# Altium project bhumishboard.PrjPcb (part 1 of 2)
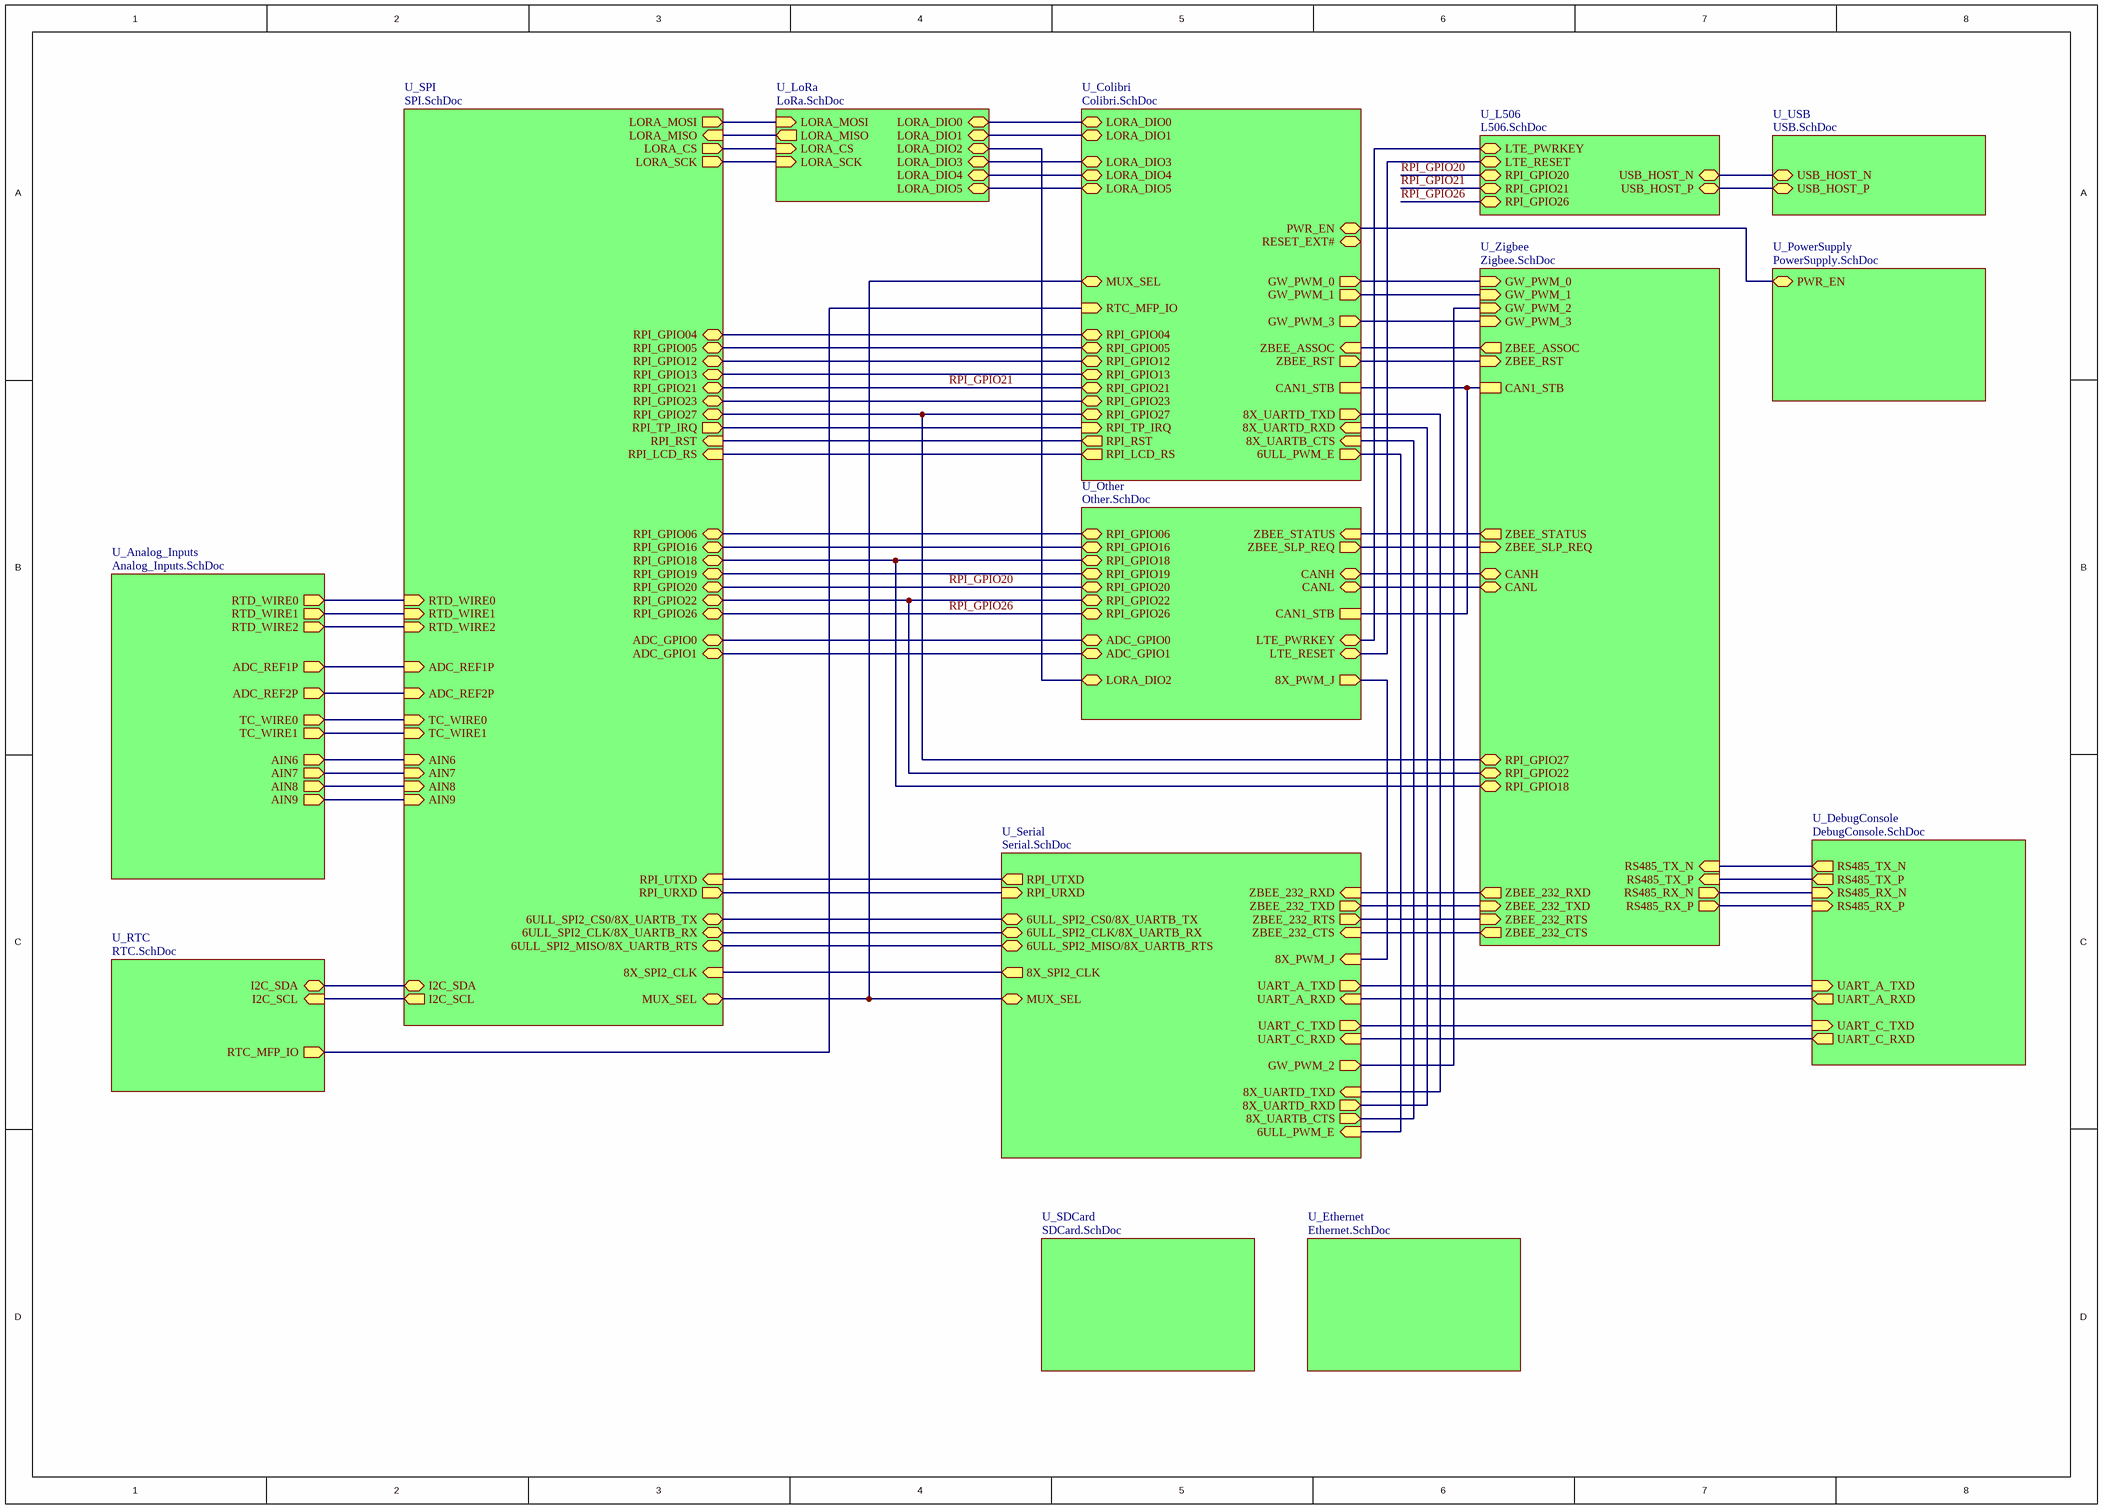
[diagram p0: HardwareArchitecture.SchDoc]
15 sheets, 269 parts. Net scope: hierarchical (ports join the sheet entries above them; power ports are global).
Sheets:
  HardwareArchitecture.SchDoc
    U_Analog_Inputs = Analog_Inputs.SchDoc
    U_Colibri = Colibri.SchDoc
    U_L506 = L506.SchDoc
    U_LoRa = LoRa.SchDoc
    U_Other = Other.SchDoc
    U_PowerSupply = PowerSupply.SchDoc
    U_SDCard = SDCard.SchDoc
    U_Serial = Serial.SchDoc
    U_SPI = SPI.SchDoc
    U_USB = USB.SchDoc
    U_Zigbee = Zigbee.SchDoc
    U_Ethernet = Ethernet.SchDoc
    U_RTC = RTC.SchDoc
    U_DebugConsole = DebugConsole.SchDoc

## Sheet HardwareArchitecture.SchDoc: Iris
size A3; Organization: Toradex AG; Address1: Altsagenstrasse 5; Address2: Horw; Address3: 6048; Address4: Switzerland; DocumentNumber: 2; Revision: V2.0; SheetNumber: 2; SheetTotal: 16; PageSetup: Record=PageOptions|CenterHorizontal=True|CenterVertical=True|PrintScale=0.73|XCorrection=1.00|YCorrection=1.00|PrintKind=0|BorderSize=5000000|LeftOffset=0|BottomOffset=0|Orientation=2|PaperLength=1000|PaperWidth=1000|Scale=100|PaperSource=7|PrintQuality=600|MediaType=1|DitherType=10|PaperKind=A4|PrintScaleMode=1

### Sub-sheets
U_Analog_Inputs = Analog_Inputs.SchDoc: ADC_REF1P (out), RTD_WIRE0 (out), RTD_WIRE1 (out), RTD_WIRE2 (out), TC_WIRE0 (out), TC_WIRE1 (out), ADC_REF2P (out), AIN8 (out), AIN9 (out), AIN7 (out), AIN6 (out)
U_Colibri = Colibri.SchDoc: RESET_EXT# (bidir), RTC_MFP_IO (in), 8X_UARTD_RXD (in), 8X_UARTD_TXD (out), 8X_UARTB_CTS (in), 6ULL_PWM_E (out), GW_PWM_3 (out), GW_PWM_0 (out), GW_PWM_1 (out), MUX_SEL (bidir), ZBEE_RST (out), RPI_LCD_RS (out), RPI_RST (out), RPI_TP_IRQ (in), LORA_DIO0 (bidir), LORA_DIO1 (bidir), LORA_DIO3 (bidir), LORA_DIO4 (bidir), LORA_DIO5 (bidir), ZBEE_ASSOC (in), RPI_GPIO04 (bidir), RPI_GPIO27 (bidir), RPI_GPIO05 (bidir), RPI_GPIO13 (bidir), RPI_GPIO21 (bidir), RPI_GPIO12 (bidir), RPI_GPIO23 (bidir), PWR_EN (bidir), CAN1_STB
U_DebugConsole = DebugConsole.SchDoc: UART_C_TXD (in), UART_C_RXD (out), UART_A_TXD (in), UART_A_RXD (out), RS485_RX_N (in), RS485_RX_P (in), RS485_TX_N (out), RS485_TX_P (out)
U_Ethernet = Ethernet.SchDoc: no entries
U_L506 = L506.SchDoc: LTE_PWRKEY (bidir), LTE_RESET (bidir), USB_HOST_N (bidir), USB_HOST_P (bidir), RPI_GPIO20 (bidir), RPI_GPIO21 (bidir), RPI_GPIO26 (bidir)
U_LoRa = LoRa.SchDoc: LORA_MISO (out), LORA_MOSI (in), LORA_CS (in), LORA_SCK (in), LORA_DIO0 (bidir), LORA_DIO1 (bidir), LORA_DIO2 (bidir), LORA_DIO4 (bidir), LORA_DIO3 (bidir), LORA_DIO5 (bidir)
U_Other = Other.SchDoc: 8X_PWM_J (out), LORA_DIO2 (bidir), ZBEE_SLP_REQ (out), ZBEE_STATUS (in), RPI_GPIO22 (bidir), RPI_GPIO06 (bidir), RPI_GPIO19 (bidir), RPI_GPIO26 (bidir), RPI_GPIO20 (bidir), RPI_GPIO16 (bidir), RPI_GPIO18 (bidir), ADC_GPIO0 (bidir), ADC_GPIO1 (bidir), CANH (bidir), CANL (bidir), LTE_PWRKEY (bidir), LTE_RESET (bidir), CAN1_STB
U_PowerSupply = PowerSupply.SchDoc: PWR_EN (bidir)
U_RTC = RTC.SchDoc: RTC_MFP_IO (out), I2C_SDA (bidir), I2C_SCL (in)
U_SDCard = SDCard.SchDoc: no entries
U_Serial = Serial.SchDoc: 8X_UARTD_RXD (out), 8X_UARTD_TXD (in), 8X_SPI2_CLK (out), 8X_UARTB_CTS (out), MUX_SEL (bidir), ZBEE_232_TXD (out), ZBEE_232_RXD (in), ZBEE_232_RTS (out), ZBEE_232_CTS (in), RPI_UTXD (out), RPI_URXD (in), 8X_PWM_J (in), 6ULL_PWM_E (in), GW_PWM_2 (out), 6ULL_SPI2_CLK/8X_UARTB_RX (bidir), 6ULL_SPI2_CS0/8X_UARTB_TX (bidir), UART_A_TXD (out), UART_A_RXD (in), UART_C_RXD (in), UART_C_TXD (out), 6ULL_SPI2_MISO/8X_UARTB_RTS (bidir)
U_SPI = SPI.SchDoc: RPI_TP_IRQ (out), RPI_LCD_RS (in), RPI_RST (in), MUX_SEL (bidir), 8X_SPI2_CLK (in), LORA_MISO (in), LORA_MOSI (out), LORA_CS (out), LORA_SCK (out), RPI_UTXD (in), RPI_URXD (out), I2C_SCL (out), I2C_SDA (bidir), RPI_GPIO04 (bidir), RPI_GPIO27 (bidir), RPI_GPIO05 (bidir), RPI_GPIO13 (bidir), RPI_GPIO21 (bidir), RPI_GPIO12 (bidir), RPI_GPIO23 (bidir), ADC_GPIO0 (bidir), ADC_GPIO1 (bidir), 6ULL_SPI2_CLK/8X_UARTB_RX (bidir), 6ULL_SPI2_CS0/8X_UARTB_TX (bidir), 6ULL_SPI2_MISO/8X_UARTB_RTS (bidir), RTD_WIRE0 (in), RTD_WIRE1 (in), TC_WIRE0 (in), TC_WIRE1 (in), AIN6 (in), AIN7 (in), AIN8 (in), AIN9 (in), ADC_REF1P (in), ADC_REF2P (in), RTD_WIRE2 (in), RPI_GPIO06 (bidir), RPI_GPIO16 (bidir), RPI_GPIO18 (bidir), RPI_GPIO19 (bidir), RPI_GPIO20 (bidir), RPI_GPIO22 (bidir), RPI_GPIO26 (bidir)
U_USB = USB.SchDoc: USB_HOST_N (bidir), USB_HOST_P (bidir)
U_Zigbee = Zigbee.SchDoc: ZBEE_RST (in), ZBEE_SLP_REQ (in), ZBEE_STATUS (out), ZBEE_ASSOC (out), CANH (bidir), GW_PWM_1 (in), GW_PWM_0 (in), GW_PWM_2 (in), GW_PWM_3 (in), RS485_TX_N (in), RS485_TX_P (in), RS485_RX_N (out), RS485_RX_P (out), CANL (bidir), ZBEE_232_RXD (out), ZBEE_232_TXD (in), ZBEE_232_RTS (in), ZBEE_232_CTS (out), RPI_GPIO27 (bidir), RPI_GPIO22 (bidir), RPI_GPIO18 (bidir), CAN1_STB

### Nets
6ULL_PWM_E: sheet U_Colibri/6ULL_PWM_E, sheet U_Serial/6ULL_PWM_E
6ULL_SPI2_CLK/8X_UARTB_RX: sheet U_Serial/6ULL_SPI2_CLK/8X_UARTB_RX, sheet U_SPI/6ULL_SPI2_CLK/8X_UARTB_RX
6ULL_SPI2_CS0/8X_UARTB_TX: sheet U_Serial/6ULL_SPI2_CS0/8X_UARTB_TX, sheet U_SPI/6ULL_SPI2_CS0/8X_UARTB_TX
6ULL_SPI2_MISO/8X_UARTB_RTS: sheet U_Serial/6ULL_SPI2_MISO/8X_UARTB_RTS, sheet U_SPI/6ULL_SPI2_MISO/8X_UARTB_RTS
8X_PWM_J: sheet U_Other/8X_PWM_J, sheet U_Serial/8X_PWM_J
8X_SPI2_CLK: sheet U_Serial/8X_SPI2_CLK, sheet U_SPI/8X_SPI2_CLK
8X_UARTB_CTS: sheet U_Colibri/8X_UARTB_CTS, sheet U_Serial/8X_UARTB_CTS
8X_UARTD_RXD: sheet U_Colibri/8X_UARTD_RXD, sheet U_Serial/8X_UARTD_RXD
8X_UARTD_TXD: sheet U_Colibri/8X_UARTD_TXD, sheet U_Serial/8X_UARTD_TXD
ADC_GPIO0: sheet U_Other/ADC_GPIO0, sheet U_SPI/ADC_GPIO0
ADC_GPIO1: sheet U_Other/ADC_GPIO1, sheet U_SPI/ADC_GPIO1
ADC_REF1P: sheet U_Analog_Inputs/ADC_REF1P, sheet U_SPI/ADC_REF1P
AIN6: sheet U_Analog_Inputs/AIN6, sheet U_SPI/AIN6
AIN7: sheet U_Analog_Inputs/AIN7, sheet U_SPI/AIN7
AIN8: sheet U_Analog_Inputs/AIN8, sheet U_SPI/AIN8
AIN9: sheet U_Analog_Inputs/ADC_REF2P, sheet U_Analog_Inputs/AIN9, sheet U_SPI/AIN9, sheet U_SPI/ADC_REF2P
CAN1_STB: sheet U_Colibri/CAN1_STB, sheet U_Other/CAN1_STB, sheet U_Zigbee/CAN1_STB
CANH: sheet U_Other/CANH, sheet U_Zigbee/CANH
CANL: sheet U_Other/CANL, sheet U_Zigbee/CANL
GW_PWM_0: sheet U_Colibri/GW_PWM_0, sheet U_Zigbee/GW_PWM_0
GW_PWM_1: sheet U_Colibri/GW_PWM_1, sheet U_Zigbee/GW_PWM_1
GW_PWM_2: sheet U_Serial/GW_PWM_2, sheet U_Zigbee/GW_PWM_2
GW_PWM_3: sheet U_Colibri/GW_PWM_3, sheet U_Zigbee/GW_PWM_3
I2C_SCL: sheet U_SPI/I2C_SCL, sheet U_RTC/I2C_SCL
I2C_SDA: sheet U_SPI/I2C_SDA, sheet U_RTC/I2C_SDA
LORA_CS: sheet U_LoRa/LORA_CS, sheet U_SPI/LORA_CS
LORA_DIO0: sheet U_Colibri/LORA_DIO0, sheet U_LoRa/LORA_DIO0
LORA_DIO1: sheet U_Colibri/LORA_DIO1, sheet U_LoRa/LORA_DIO1
LORA_DIO2: sheet U_LoRa/LORA_DIO2, sheet U_Other/LORA_DIO2
LORA_DIO3: sheet U_Colibri/LORA_DIO3, sheet U_LoRa/LORA_DIO3
LORA_DIO4: sheet U_Colibri/LORA_DIO4, sheet U_LoRa/LORA_DIO4
LORA_DIO5: sheet U_Colibri/LORA_DIO5, sheet U_LoRa/LORA_DIO5
LORA_MISO: sheet U_LoRa/LORA_MISO, sheet U_SPI/LORA_MISO
LORA_MOSI: sheet U_LoRa/LORA_MOSI, sheet U_SPI/LORA_MOSI
LORA_SCK: sheet U_LoRa/LORA_SCK, sheet U_SPI/LORA_SCK
LTE_PWRKEY: sheet U_L506/LTE_PWRKEY, sheet U_Other/LTE_PWRKEY
LTE_RESET: sheet U_L506/LTE_RESET, sheet U_Other/LTE_RESET
MUX_SEL: sheet U_Colibri/MUX_SEL, sheet U_Serial/MUX_SEL, sheet U_SPI/MUX_SEL
PWR_EN: sheet U_Colibri/PWR_EN, sheet U_PowerSupply/PWR_EN
RPI_GPIO04: sheet U_Colibri/RPI_GPIO04, sheet U_SPI/RPI_GPIO04
RPI_GPIO05: sheet U_Colibri/RPI_GPIO05, sheet U_SPI/RPI_GPIO05
RPI_GPIO06: sheet U_Other/RPI_GPIO06, sheet U_SPI/RPI_GPIO06
RPI_GPIO12: sheet U_Colibri/RPI_GPIO12, sheet U_SPI/RPI_GPIO12
RPI_GPIO13: sheet U_Colibri/RPI_GPIO13, sheet U_SPI/RPI_GPIO13
RPI_GPIO16: sheet U_Other/RPI_GPIO16, sheet U_SPI/RPI_GPIO16
RPI_GPIO18: sheet U_Other/RPI_GPIO18, sheet U_SPI/RPI_GPIO18, sheet U_Zigbee/RPI_GPIO18
RPI_GPIO19: sheet U_Other/RPI_GPIO19, sheet U_SPI/RPI_GPIO19
RPI_GPIO20: sheet U_L506/RPI_GPIO20, sheet U_Other/RPI_GPIO20, sheet U_SPI/RPI_GPIO20
RPI_GPIO21: sheet U_Colibri/RPI_GPIO21, sheet U_L506/RPI_GPIO21, sheet U_SPI/RPI_GPIO21
RPI_GPIO22: sheet U_Other/RPI_GPIO22, sheet U_SPI/RPI_GPIO22, sheet U_Zigbee/RPI_GPIO22
RPI_GPIO23: sheet U_Colibri/RPI_GPIO23, sheet U_SPI/RPI_GPIO23
RPI_GPIO26: sheet U_L506/RPI_GPIO26, sheet U_Other/RPI_GPIO26, sheet U_SPI/RPI_GPIO26
RPI_GPIO27: sheet U_Colibri/RPI_GPIO27, sheet U_SPI/RPI_GPIO27, sheet U_Zigbee/RPI_GPIO27
RPI_LCD_RS: sheet U_Colibri/RPI_LCD_RS, sheet U_SPI/RPI_LCD_RS
RPI_RST: sheet U_Colibri/RPI_RST, sheet U_SPI/RPI_RST
RPI_TP_IRQ: sheet U_Colibri/RPI_TP_IRQ, sheet U_SPI/RPI_TP_IRQ
RPI_URXD: sheet U_Serial/RPI_URXD, sheet U_SPI/RPI_URXD
RPI_UTXD: sheet U_Serial/RPI_UTXD, sheet U_SPI/RPI_UTXD
RS485_RX_N: sheet U_Zigbee/RS485_RX_N, sheet U_DebugConsole/RS485_RX_N
RS485_RX_P: sheet U_Zigbee/RS485_RX_P, sheet U_DebugConsole/RS485_RX_P
RS485_TX_N: sheet U_Zigbee/RS485_TX_N, sheet U_DebugConsole/RS485_TX_N
RS485_TX_P: sheet U_Zigbee/RS485_TX_P, sheet U_DebugConsole/RS485_TX_P
RTC_MFP_IO: sheet U_Colibri/RTC_MFP_IO, sheet U_RTC/RTC_MFP_IO
RTD_WIRE0: sheet U_Analog_Inputs/RTD_WIRE0, sheet U_SPI/RTD_WIRE0
RTD_WIRE1: sheet U_Analog_Inputs/RTD_WIRE1, sheet U_SPI/RTD_WIRE1
RTD_WIRE2: sheet U_Analog_Inputs/RTD_WIRE2, sheet U_SPI/RTD_WIRE2
TC_WIRE0: sheet U_Analog_Inputs/TC_WIRE0, sheet U_SPI/TC_WIRE0
TC_WIRE1: sheet U_Analog_Inputs/TC_WIRE1, sheet U_SPI/TC_WIRE1
UART_A_RXD: sheet U_Serial/UART_A_RXD, sheet U_DebugConsole/UART_A_RXD
UART_A_TXD: sheet U_Serial/UART_A_TXD, sheet U_DebugConsole/UART_A_TXD
UART_C_RXD: sheet U_Serial/UART_C_RXD, sheet U_DebugConsole/UART_C_RXD
UART_C_TXD: sheet U_Serial/UART_C_TXD, sheet U_DebugConsole/UART_C_TXD
USB_HOST_N: sheet U_L506/USB_HOST_N, sheet U_USB/USB_HOST_N
USB_HOST_P: sheet U_L506/USB_HOST_P, sheet U_USB/USB_HOST_P
ZBEE_232_CTS: sheet U_Serial/ZBEE_232_CTS, sheet U_Zigbee/ZBEE_232_CTS
ZBEE_232_RTS: sheet U_Serial/ZBEE_232_RTS, sheet U_Zigbee/ZBEE_232_RTS
ZBEE_232_RXD: sheet U_Serial/ZBEE_232_RXD, sheet U_Zigbee/ZBEE_232_RXD
ZBEE_232_TXD: sheet U_Serial/ZBEE_232_TXD, sheet U_Zigbee/ZBEE_232_TXD
ZBEE_ASSOC: sheet U_Colibri/ZBEE_ASSOC, sheet U_Zigbee/ZBEE_ASSOC
ZBEE_RST: sheet U_Colibri/ZBEE_RST, sheet U_Zigbee/ZBEE_RST
ZBEE_SLP_REQ: sheet U_Other/ZBEE_SLP_REQ, sheet U_Zigbee/ZBEE_SLP_REQ
ZBEE_STATUS: sheet U_Other/ZBEE_STATUS, sheet U_Zigbee/ZBEE_STATUS

### Notes on the sheet
- Title
- Size:
- Date:
- A3
- Number:
- Time:
- Revision:
- Sheet
- of
- File:

## Sheet Analog_Inputs.SchDoc
size A4
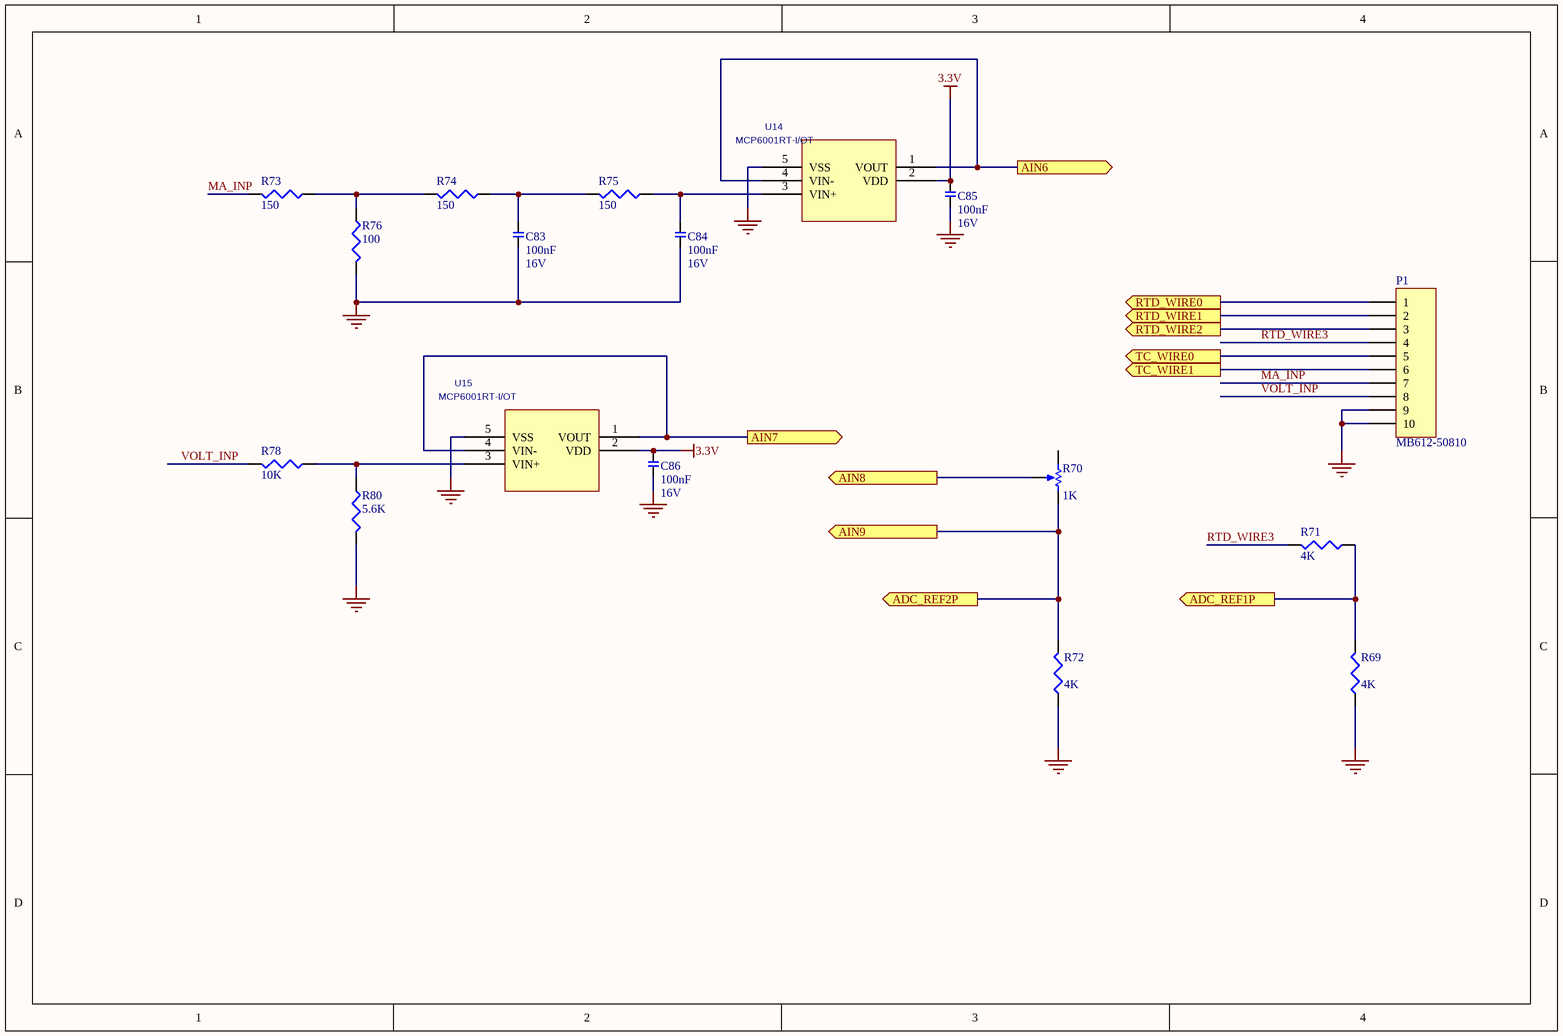
[diagram p1: Analog_Inputs.SchDoc]

### Parts
C83  Rating: 16V  [T_CAPC0603X33N]  (hidden comment: 100nF)
C84  Rating: 16V  [T_CAPC0603X33N]  (hidden comment: 100nF)
C85  Rating: 16V  [T_CAPC0603X33N]  (hidden comment: 100nF)
C86  Rating: 16V  [T_CAPC0603X33N]  (hidden comment: 100nF)
P1  MB612-50810  [1729186 5.08 - 10pos]
R69  value 4K  [J1-0603]  (hidden comment: Res3)
R70  value 1K  [VR5]  (hidden comment: RPot)
R71  value 4K  [J1-0603]  (hidden comment: Res3)
R72  value 4K  [J1-0603]  (hidden comment: Res3)
R73  value 150  [J1-0603]  (hidden comment: Res3)
R74  value 150  [J1-0603]  (hidden comment: Res3)
R75  value 150  [J1-0603]  (hidden comment: Res3)
R76  value 100  [J1-0603]  (hidden comment: Res3)
R78  value 10K  [J1-0603]  (hidden comment: Res3)
R80  value 5.6K  [J1-0603]  (hidden comment: Res3)
U14  MCP6001RT-I/OT  [SOT-23-5]
U15  MCP6001RT-I/OT  [SOT-23-5]

### Ports
ADC_REF1P (out), ADC_REF2P (out), AIN6 (out), AIN7 (out), AIN8 (out), AIN9 (out), RTD_WIRE0 (out), RTD_WIRE1 (out), RTD_WIRE2 (out), TC_WIRE0 (out), TC_WIRE1 (out)

### Nets
3.3V: C85.2 C86.2 U14.2(VDD) U15.2(VDD)
GND: C83.1 C84.1 C85.1 C86.1 P1.9 P1.10 R69.1 R72.1 R76.2 R80.2 U14.5(VSS) U15.5(VSS)
ADC_REF1P: R69.2 R71.1 ; port ADC_REF1P
AIN6: U14.1(VOUT) U14.4(VIN-) ; port AIN6
AIN7: U15.1(VOUT) U15.4(VIN-) ; port AIN7
AIN8: R70.3(TAP) ; port AIN8
AIN9: R70.2(BOT) R72.2 ; port ADC_REF2P, port AIN9
MA_INP: P1.7 R73.2
RTD_WIRE0: P1.1 ; port RTD_WIRE0
RTD_WIRE1: P1.2 ; port RTD_WIRE1
RTD_WIRE2: P1.3 ; port RTD_WIRE2
RTD_WIRE3: P1.4 R71.2
TC_WIRE0: P1.5 ; port TC_WIRE0
TC_WIRE1: P1.6 ; port TC_WIRE1
VOLT_INP: P1.8 R78.2
NetC83_2: C83.2 R74.1 R75.2
NetC84_2: C84.2 R75.1 U14.3(VIN+)
NetR73_1: R73.1 R74.2 R76.1
NetR78_1: R78.1 R80.1 U15.3(VIN+)

Not connected (* = marked no-connect by the designer): R70 1(TOP)

### Library data of the parts
C83-C86 = C-X7R-100nF-16V-10%-0603: Capacitor Ceramic X7R 100nF 16V 10% 0603; Tolerance: 10%; Type: X7R; Value: 100nF
P1 = Header 10: Header, 10-Pin; LatestRevisionDate: 17-Jul-2002; LatestRevisionNote: Re-released for DXP Platform.; Publisher: Altium Limited
R69 R71-R76 R78 R80 = Res3: Resistor; Published: 8-Jun-2000; LatestRevisionDate: 29-May-2009; LatestRevisionNote: IPC-7351 Footprint Added.; PackageReference: J1-0603; Publisher: Altium Limited; PackageDescription: Chip Resistor
R70 = RPot: Potentiometer; Sim Note: Enter the Resistance value and the set point into parameter fields.; Set Position: 0.5; Published: 8-Jun-2000; LatestRevisionDate: 17-Jul-2002; LatestRevisionNote: Re-released for DXP Platform.; PackageReference: VR5; Publisher: Altium Limited; PackageDescription: Variable Resistor, Thru-Hole; 3 Leads
U14 U15 = MCP6001RT-I/OT: C: Copyright (C) 2015 Accelerated Designs. All rights reserved; Vendor: Microchip; Built_By: EMA_UL_Team; SourceLibrary: Microchip_2011-05-13; Value: mcp6001rt-i/ot; Manufacturer_Part_Number: mcp6001rt-i/ot

## Sheet Colibri.SchDoc: Iris
size A3; Organization: Toradex AG; Address1: Altsagenstrasse 5; Address2: Horw; Address3: 6048; Address4: Switzerland; DocumentNumber: 4; Revision: V2.0; SheetNumber: 4; SheetTotal: 16
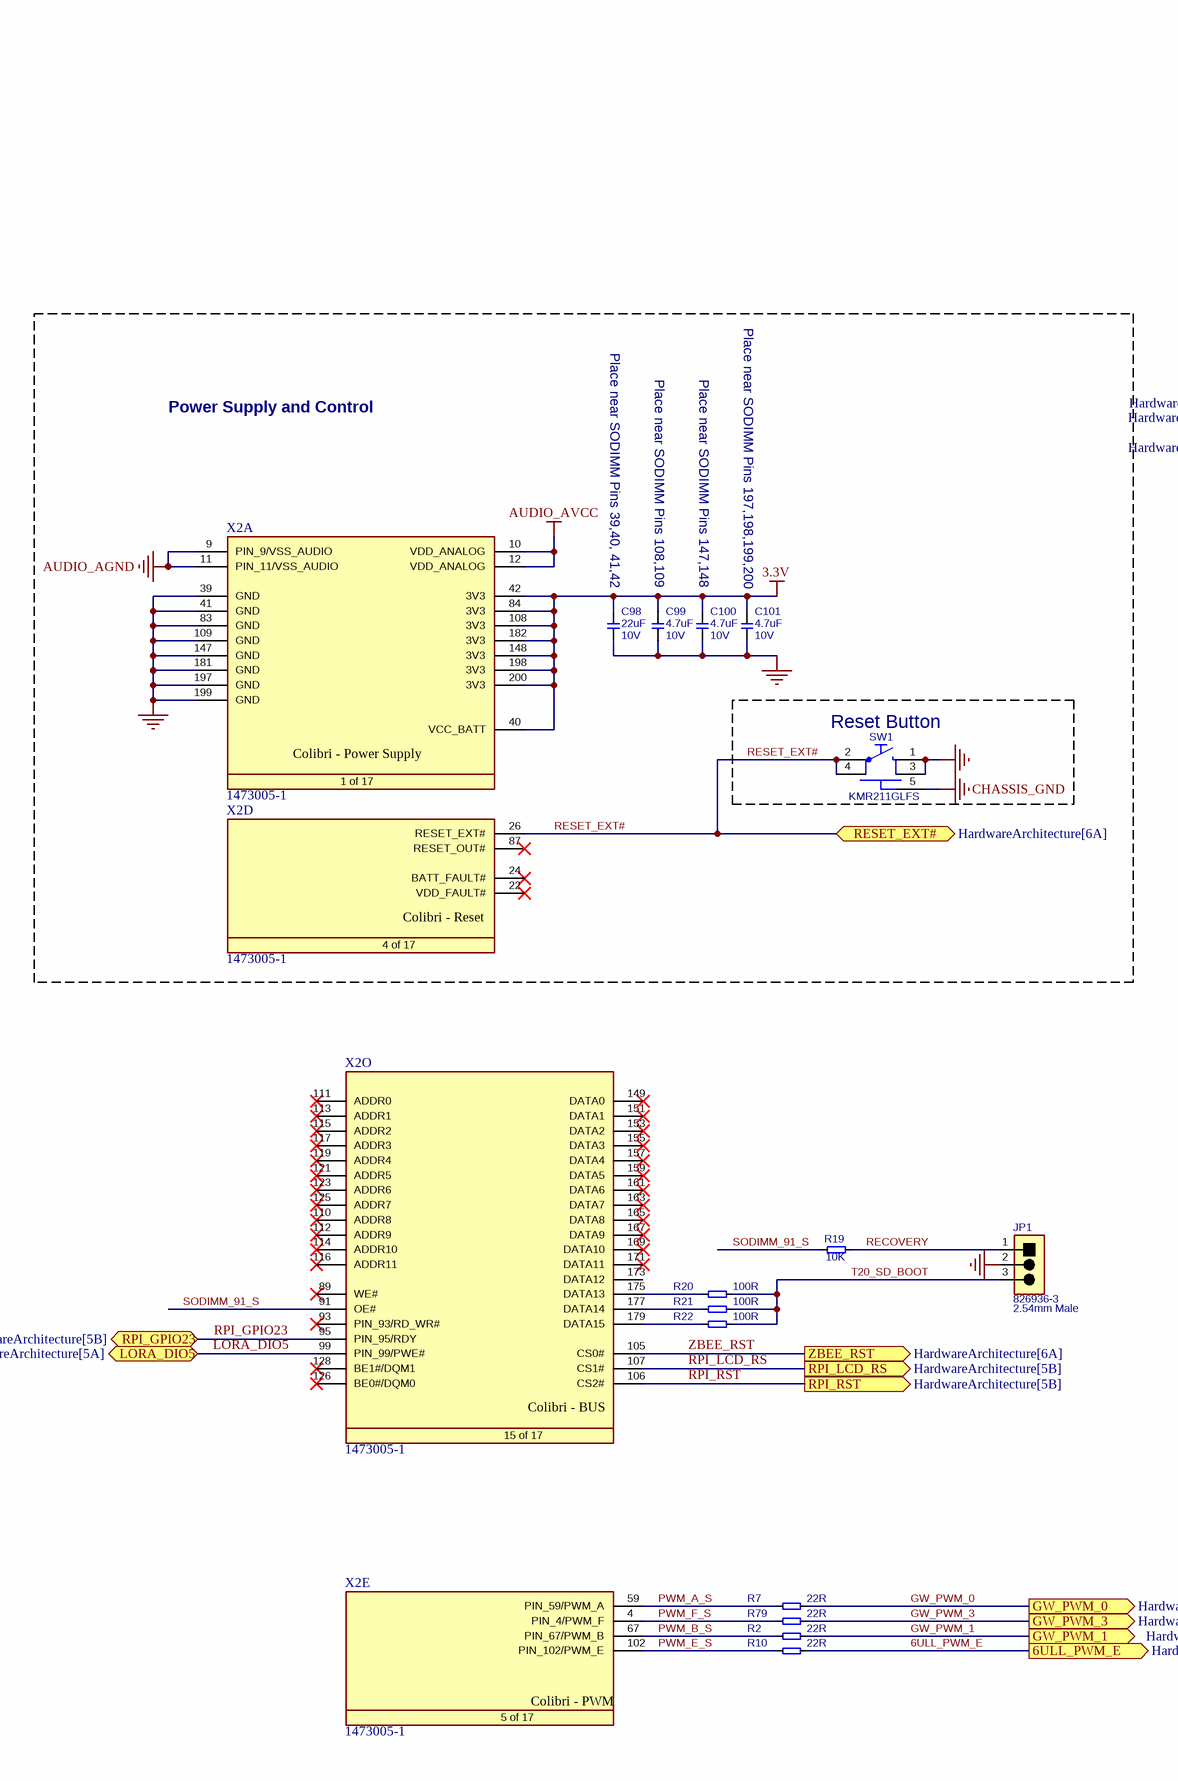
[diagram p2: Colibri.SchDoc, left]
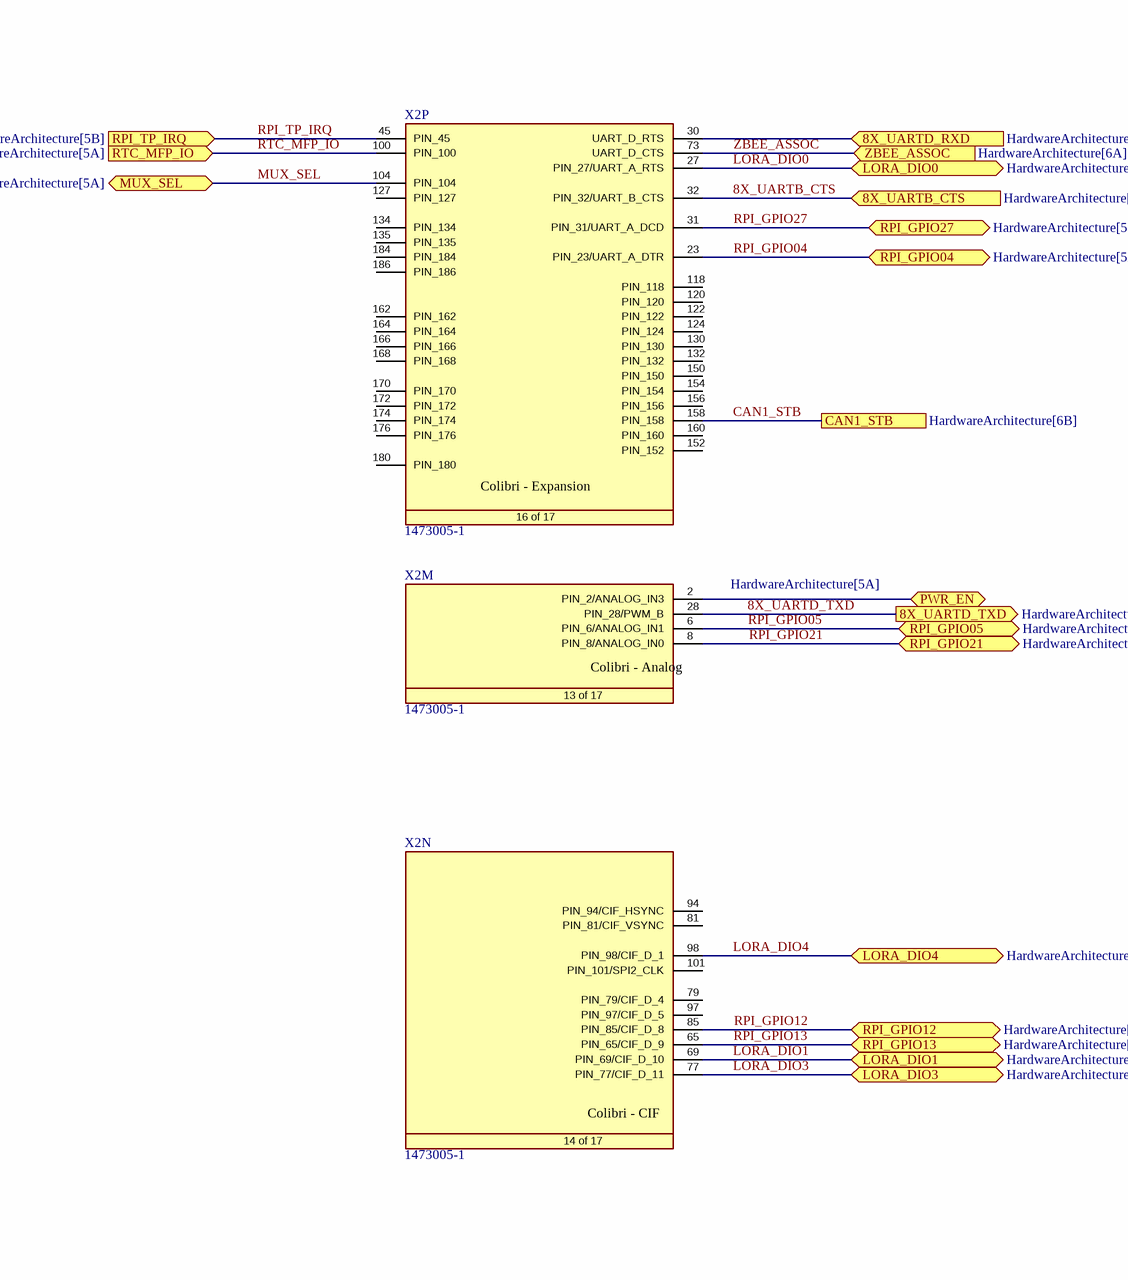
[diagram p3: Colibri.SchDoc, right]

### Parts
C98  Rating: 10V  [T_CAPC0805X125N]  (hidden comment: 22uF)
C99  Rating: 10V  [T_CAPC0603X33N]  (hidden comment: 4.7uF)
C100  Rating: 10V  [T_CAPC0603X33N]  (hidden comment: 4.7uF)
C101  Rating: 10V  [T_CAPC0603X33N]  (hidden comment: 4.7uF)
JP1  826936-3  [T_TYCO_826936-3]
R2  22R  [RESC1005X40N]
R7  22R  [RESC1005X40N]
R10  22R  [RESC1005X40N]
R19  10K  [RESC1005X40N]
R20  100R  [T_RESC0603X30N]
R21  100R  [T_RESC0603X30N]
R22  100R  [T_RESC0603X30N]
R79  22R  [RESC1005X40N]
SW1  KMR211GLFS  [T_CnK_KMR211GLFS]
X2  1473005-1  [T_Tyco_1473005-1]  (parts A,D,E,M,N,O,P of 17)

### Blocks framed on the sheet
Power Supply and Control: C98-C101 X2
Reset Button: SW1

### Ports
6ULL_PWM_E (out, see HardwareArchitecture[6B]), 8X_UARTB_CTS (in, see HardwareArchitecture[6B]), 8X_UARTD_RXD (in, see HardwareArchitecture[6B]), 8X_UARTD_TXD (out, see HardwareArchitecture[6B]), CAN1_STB (see HardwareArchitecture[6B]), GW_PWM_0 (out, see HardwareArchitecture[6A]), GW_PWM_1 (out, see HardwareArchitecture[6A]), GW_PWM_3 (out, see HardwareArchitecture[6A]), LORA_DIO0 (bidir, see HardwareArchitecture[5A]), LORA_DIO1 (bidir, see HardwareArchitecture[5A]), LORA_DIO3 (bidir, see HardwareArchitecture[5A]), LORA_DIO4 (bidir, see HardwareArchitecture[5A]), LORA_DIO5 (bidir, see HardwareArchitecture[5A]), MUX_SEL (bidir, see HardwareArchitecture[5A]), PWR_EN (bidir, see HardwareArchitecture[5A]), RESET_EXT# (bidir, see HardwareArchitecture[6A]), RPI_GPIO04 (bidir, see HardwareArchitecture[5A]), RPI_GPIO05 (bidir, see HardwareArchitecture[5A]), RPI_GPIO12 (bidir, see HardwareArchitecture[5A]), RPI_GPIO13 (bidir, see HardwareArchitecture[5A]), RPI_GPIO21 (bidir, see HardwareArchitecture[5B]), RPI_GPIO23 (bidir, see HardwareArchitecture[5B]), RPI_GPIO27 (bidir, see HardwareArchitecture[5B]), RPI_LCD_RS (out, see HardwareArchitecture[5B]), RPI_RST (out, see HardwareArchitecture[5B]), RPI_TP_IRQ (in, see HardwareArchitecture[5B]), RTC_MFP_IO (in, see HardwareArchitecture[5A]), ZBEE_ASSOC (in, see HardwareArchitecture[6A]), ZBEE_RST (out, see HardwareArchitecture[6A])

### Nets
3.3V: C98.2 C99.1 C100.1 C101.1 X2.40(VCC_BATT) X2.42(3V3) X2.84(3V3) X2.108(3V3) X2.148(3V3) X2.182(3V3) X2.198(3V3) X2.200(3V3)
AUDIO_AGND: X2.9(PIN_9/VSS_AUDIO) X2.11(PIN_11/VSS_AUDIO)
AUDIO_AVCC: X2.10(VDD_ANALOG) X2.12(VDD_ANALOG)
CHASSIS_GND: SW1.5
GND: C98.1 C99.2 C100.2 C101.2 JP1.2 SW1.1 SW1.3 X2.39(GND) X2.41(GND) X2.83(GND) X2.109(GND) X2.147(GND) X2.181(GND) X2.197(GND) X2.199(GND)
6ULL_PWM_E: R10.2 ; port 6ULL_PWM_E
8X_UARTB_CTS: X2.32(PIN_32/UART_B_CTS) ; port 8X_UARTB_CTS
8X_UARTD_RXD: X2.30(UART_D_RTS) ; port 8X_UARTD_RXD
8X_UARTD_TXD: X2.28(PIN_28/PWM_B) ; port 8X_UARTD_TXD
CAN1_STB: X2.158(PIN_158) ; port CAN1_STB
GW_PWM_0: R7.2 ; port GW_PWM_0
GW_PWM_1: R2.2 ; port GW_PWM_1
GW_PWM_3: R79.2 ; port GW_PWM_3
LORA_DIO0: X2.27(PIN_27/UART_A_RTS) ; port LORA_DIO0
LORA_DIO1: X2.69(PIN_69/CIF_D_10) ; port LORA_DIO1
LORA_DIO3: X2.77(PIN_77/CIF_D_11) ; port LORA_DIO3
LORA_DIO4: X2.98(PIN_98/CIF_D_1) ; port LORA_DIO4
LORA_DIO5: X2.99(PIN_99/PWE#) ; port LORA_DIO5
MUX_SEL: X2.104(PIN_104) ; port MUX_SEL
PWM_A_S: R7.1 X2.59(PIN_59/PWM_A)
PWM_B_S: R2.1 X2.67(PIN_67/PWM_B)
PWM_E_S: R10.1 X2.102(PIN_102/PWM_E)
PWM_F_S: R79.1 X2.4(PIN_4/PWM_F)
PWR_EN: X2.2(PIN_2/ANALOG_IN3) ; port PWR_EN
RECOVERY: JP1.1 R19.2
RESET_EXT#: SW1.2 SW1.4 X2.26(RESET_EXT#) ; port RESET_EXT#
RPI_GPIO04: X2.23(PIN_23/UART_A_DTR) ; port RPI_GPIO04
RPI_GPIO05: X2.6(PIN_6/ANALOG_IN1) ; port RPI_GPIO05
RPI_GPIO12: X2.85(PIN_85/CIF_D_8) ; port RPI_GPIO12
RPI_GPIO13: X2.65(PIN_65/CIF_D_9) ; port RPI_GPIO13
RPI_GPIO21: X2.8(PIN_8/ANALOG_IN0) ; port RPI_GPIO21
RPI_GPIO23: X2.95(PIN_95/RDY) ; port RPI_GPIO23
RPI_GPIO27: X2.31(PIN_31/UART_A_DCD) ; port RPI_GPIO27
RPI_LCD_RS: X2.107(CS1#) ; port RPI_LCD_RS
RPI_RST: X2.106(CS2#) ; port RPI_RST
RPI_TP_IRQ: X2.45(PIN_45) ; port RPI_TP_IRQ
RTC_MFP_IO: X2.100(PIN_100) ; port RTC_MFP_IO
SODIMM_91_S: R19.1 X2.91(OE#)
T20_SD_BOOT: JP1.3 R20.1 R21.1 R22.1
ZBEE_ASSOC: X2.73(UART_D_CTS) ; port ZBEE_ASSOC
ZBEE_RST: X2.105(CS0#) ; port ZBEE_RST
NetR20_2: R20.2 X2.175(DATA13)
NetR21_2: R21.2 X2.177(DATA14)
NetR22_2: R22.2 X2.179(DATA15)

Not connected (* = marked no-connect by the designer): X2 22(VDD_FAULT#)* 24(BATT_FAULT#)* 79(PIN_79/CIF_D_4) 81(PIN_81/CIF_VSYNC) 87(RESET_OUT#)* 89(WE#)* 93(PIN_93/RD_WR#)* 94(PIN_94/CIF_HSYNC) 97(PIN_97/CIF_D_5) 101(PIN_101/SPI2_CLK) 110(ADDR8)* 111(ADDR0)* 112(ADDR9)* 113(ADDR1)* 114(ADDR10)* 115(ADDR2)* 116(ADDR11)* 117(ADDR3)* 118(PIN_118) 119(ADDR4)* 120(PIN_120) 121(ADDR5)* 122(PIN_122) 123(ADDR6)* 124(PIN_124) 125(ADDR7)* 126(BE0#/DQM0)* 127(PIN_127) 128(BE1#/DQM1)* 130(PIN_130) 132(PIN_132) 134(PIN_134) 135(PIN_135) 149(DATA0)* 150(PIN_150) 151(DATA1)* 152(PIN_152) 153(DATA2)* 154(PIN_154) 155(DATA3)* 156(PIN_156) 157(DATA4)* 159(DATA5)* 160(PIN_160) 161(DATA6)* 162(PIN_162) 163(DATA7)* 164(PIN_164) 165(DATA8)* 166(PIN_166) 167(DATA9)* 168(PIN_168) 169(DATA10)* 170(PIN_170) 171(DATA11)* 172(PIN_172) 173(DATA12) 174(PIN_174) 176(PIN_176) 180(PIN_180) 184(PIN_184) 186(PIN_186)

### Notes on the sheet
- Place near SODIMM Pins 39,40, 41,42
- Place near SODIMM Pins 197,198,199,200
- Place near SODIMM Pins 108,109
- Place near SODIMM Pins 147,148
- (near JP1) 2.54mm Male
- Title
- Size:
- Date:
- A3
- Number:
- Time:
- Revision:
- Sheet
- of
- File:
- (in symbol CON-Tyco-1473005-1-200-0.6mm, part A) Colibri - Power Supply; 1 of 17
- (in symbol CON-Tyco-1473005-1-200-0.6mm, part D) Colibri - Reset; 4 of 17
- (in symbol CON-Tyco-1473005-1-200-0.6mm, part E) Colibri - PWM; 5 of 17
- (in symbol CON-Tyco-1473005-1-200-0.6mm, part M) Colibri - Analog; 13 of 17
- (in symbol CON-Tyco-1473005-1-200-0.6mm, part N) Colibri - CIF; 14 of 17
- (in symbol CON-Tyco-1473005-1-200-0.6mm, part O) Colibri - BUS; 15 of 17
- (in symbol CON-Tyco-1473005-1-200-0.6mm, part P) Colibri - Expansion; 16 of 17

### Library data of the parts
C98 = C-X5R-22uF-10V-20%-0805: Capacitor Ceramic X5R 22uF 10V 20% 0805; Tolerance: 20%; Type: X5R; Value: 22uF
C99-C101 = C-X5R-4.7uF-10V-10%-0603: Capacitor Ceramic X5R 4.7uF 10V 10% 0603; Manufacturer Name: Generic; Tolerance: 10%; Type: X5R; Value: 4.7uF; Manufacturer Part No.: *
JP1 = CON-Tyco-826936-3-1X3-2.54mm-JP: Jumper, 3-Pin; Manufacturer Name: Tyco; No. of ways: 1X3; Pitch: 2.54mm; Manufacturer Part No.: 826936-3
R2 R7 R10 R79 = R-22R-63mW-5%-0402: Resistor 22 ohm 63mW 5% 0402; Rating: 63mW; Tolerance: 5%; Value: 22R
R19 = R-10KR-63mW-1%-0402: Resistor 10 Kohm 63mW 1% 0402; Value: 10KR; Rating: 63mW; Tolerance: 1%
R20-R22 = R-100R-63mW-5%-0603: Resistor 100 ohm 63mW 5% 0603; Rating: 63mW; Tolerance: 5%; Value: 100R
SW1 = SW_CnK-KMR211GLFS-1VA: Power ON Switch; Manufacturer Name: C&N; Rating: 1VA; Manufacturer Part No.: KMR211GLFS
X2 = CON-Tyco-1473005-1-200-0.6mm: SODIMM Connector; Manufacturer Name: Tyco; No. of ways: 200; Manufacturer Part No.: 1473005-1

## Sheet L506.SchDoc
size A3
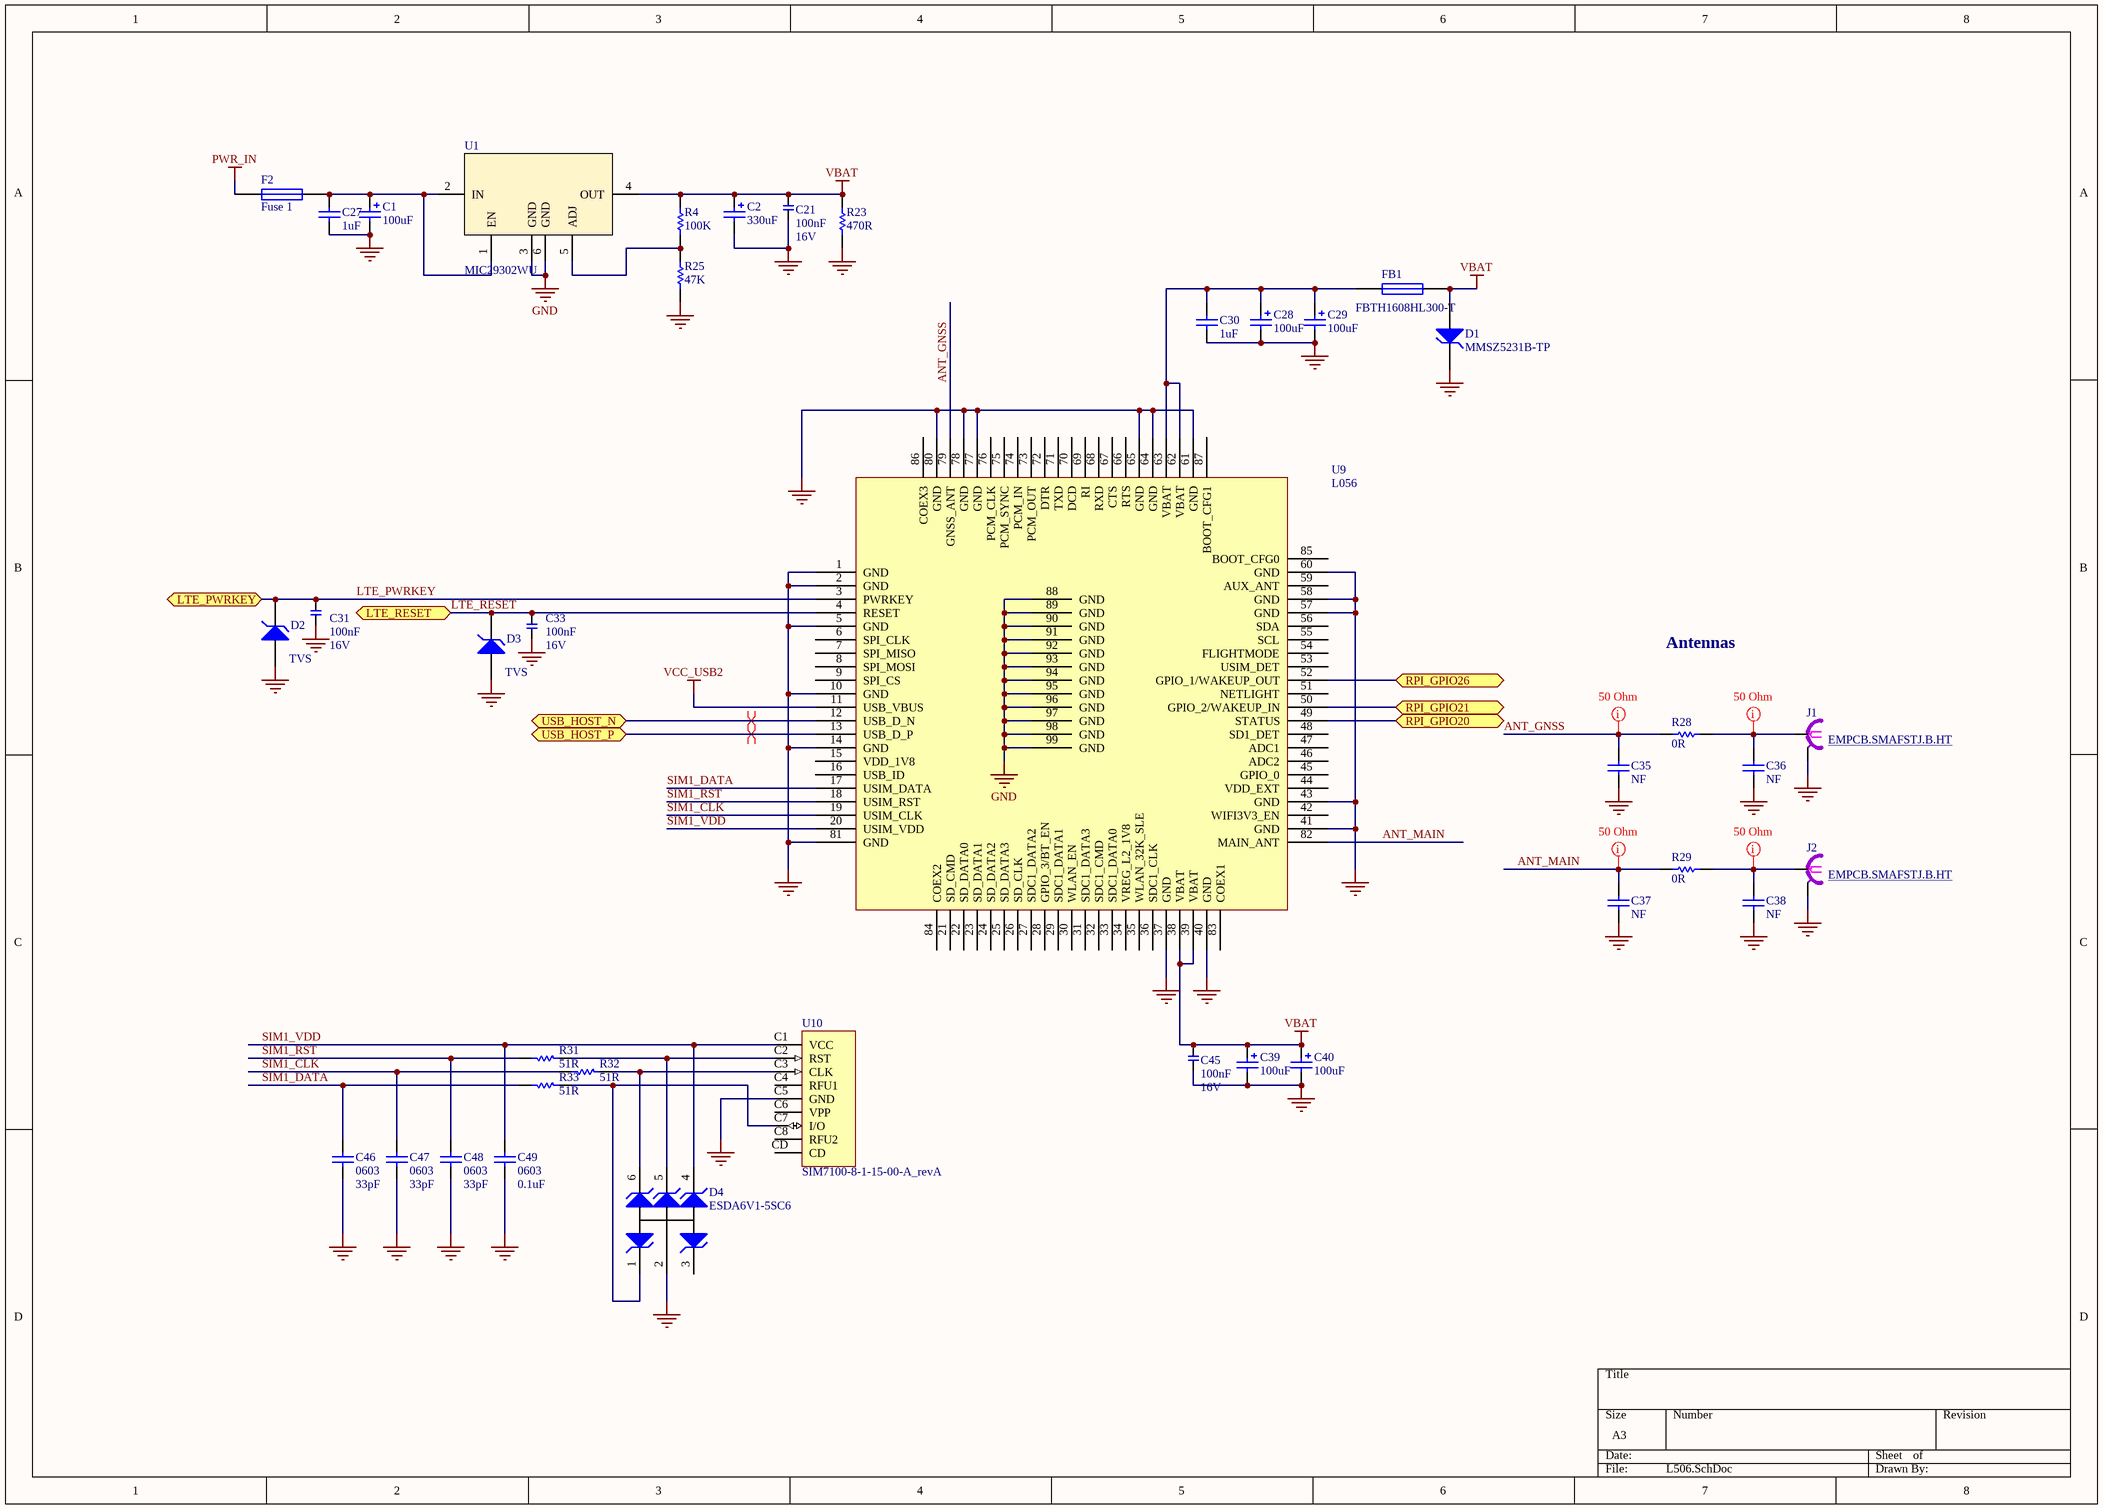
[diagram p4: L506.SchDoc]

### Parts
C1  100uF  [2312 Tant]
C2  330uF  [2312 Tant]
C21  Rating: 16V  [T_CAPC0603X33N]  (hidden comment: 100nF)
C27  1uF  [CAPC1608X100N]
C28  100uF  [2312 Tant]
C29  100uF  [2312 Tant]
C30  1uF  [CAPC1608X100N]
C31  Rating: 16V  [T_CAPC0603X33N]  (hidden comment: 100nF)
C33  Rating: 16V  [T_CAPC0603X33N]  (hidden comment: 100nF)
C35  NF  [CAPC1608X100N]
C36  NF  [CAPC1608X100N]
C37  NF  [CAPC1608X100N]
C38  NF  [CAPC1608X100N]
C39  100uF  [2312 Tant]
C40  100uF  [2312 Tant]
C45  Rating: 16V  [T_CAPC0603X33N]  (hidden comment: 100nF)
C46  0603  value 33pF  [CAPC1608X100N]
C47  0603  value 33pF  [CAPC1608X100N]
C48  0603  value 33pF  [CAPC1608X100N]
C49  0603  value 0.1uF  [CAPC1608X100N]
D1  MMSZ5231B-TP  [SOD3715X145N]
D2  TVS  [SOD3715X145N]
D3  TVS  [SOD3715X145N]
D4  ESDA6V1-5SC6  [SOT95P280X100-6N]
F2  Fuse 1  [SSQC_BEL]
FB1  FBTH1608HL300-T  [IND-0603]
J1  EMPCB.SMAFSTJ.B.HT  [EMPCB.SMAFSTJ.B.HT]
J2  EMPCB.SMAFSTJ.B.HT  [EMPCB.SMAFSTJ.B.HT]
R4  100K  [RESC1608X50N]
R23  470R  [RESC1608X50N]
R25  47K  [RESC1608X50N]
R28  0R  [RESC1608X50N]
R29  0R  [RESC1608X50N]
R31  51R  [RESC1608X50N]
R32  51R  [RESC1608X50N]
R33  51R  [RESC1608X50N]
U1  MIC29302WU  [MIC29302WU]
U9  L056  [L506]
U10  SIM7100-8-1-15-00-A_revA  [SIM7100-8-1-15-00-A_revA]

### Ports
LTE_PWRKEY (bidir), LTE_RESET (bidir), RPI_GPIO20 (bidir), RPI_GPIO21 (bidir), RPI_GPIO26 (bidir), USB_HOST_N (bidir), USB_HOST_P (bidir)

### Nets
GND: C1.2 C2.2 C21.1 C27.2 C28.2 C29.2 C30.2 C31.1 C33.1 C35.1 C36.1 C37.1 C38.1 C39.2 C40.2 C45.1 C46.2 C47.2 C48.2 C49.2 D1.2(K) D2.1(A) D3.1(A) D4.2(K) J1.2(GND) J2.2(GND) R23.2 R25.2 U1.3(GND) U1.6(GND) U9.1(GND) U9.2(GND) U9.5(GND) U9.10(GND) U9.14(GND) U9.37(GND) U9.40(GND) U9.41(GND) U9.43(GND) U9.57(GND) U9.58(GND) U9.60(GND) U9.61(GND) U9.64(GND) U9.65(GND) U9.77(GND) U9.78(GND) U9.80(GND) U9.81(GND) U9.88(GND) U9.89(GND) U9.90(GND) U9.91(GND) U9.92(GND) U9.93(GND) U9.94(GND) U9.95(GND) U9.96(GND) U9.97(GND) U9.98(GND) U9.99(GND) U10.C5(GND)
PWR_IN: F2.1
VBAT: C2.1 C21.2 C39.1 C40.1 C45.2 D1.1(A) FB1.2 R4.1 R23.1 U1.4(OUT) U9.38(VBAT) U9.39(VBAT)
VCC_USB2: U9.11(USB_VBUS)
ANT_GNSS: C35.2 R28.1 U9.79(GNSS_ANT)
ANT_MAIN: C37.2 R29.1 U9.82(MAIN_ANT)
LTE_PWRKEY: C31.2 D2.2(K) U9.3(PWRKEY) ; port LTE_PWRKEY
LTE_RESET: C33.2 D3.2(K) U9.4(RESET) ; port LTE_RESET
RPI_GPIO20: U9.49(STATUS) ; port RPI_GPIO20
RPI_GPIO21: U9.50(GPIO_2/WAKEUP_IN) ; port RPI_GPIO21
RPI_GPIO26: U9.52(GPIO_1/WAKEUP_OUT) ; port RPI_GPIO26
SIM1_CLK: C47.1 R32.1 U9.19(USIM_CLK)
SIM1_DATA: C46.1 R33.1 U9.17(USIM_DATA)
SIM1_RST: C48.1 R31.1 U9.18(USIM_RST)
SIM1_VDD: C49.1 D4.4(A) U9.20(USIM_VDD) U10.C1(VCC)
USB_HOST_N: U9.12(USB_D_N) ; port USB_HOST_N
USB_HOST_P: U9.13(USB_D_P) ; port USB_HOST_P
NetC1_1: C1.1 C27.1 F2.2 U1.1(EN) U1.2(IN)
NetC28_1: C28.1 C29.1 C30.1 FB1.1 U9.62(VBAT) U9.63(VBAT)
NetC36_2: C36.2 J1.1(Signal) R28.2
NetC38_2: C38.2 J2.1(Signal) R29.2
NetD4_1: D4.1(K) R33.2 U10.C7(I/O)
NetD4_5: D4.5(A) R31.2 U10.C2(RST)
NetD4_6: D4.6(A) R32.2 U10.C3(CLK)
NetR4_2: R4.2 R25.1 U1.5(ADJ)

Not connected (* = marked no-connect by the designer): D4 3(K); U9 6(SPI_CLK) 7(SPI_MISO) 8(SPI_MOSI) 9(SPI_CS) 15(VDD_1V8) 16(USB_ID) 21(SD_CMD) 22(SD_DATA0) 23(SD_DATA1) 24(SD_DATA2) 25(SD_DATA3) 26(SD_CLK) 27(SDC1_DATA2) 28(GPIO_3/BT_EN) 29(SDC1_DATA1) 30(WLAN_EN) 31(SDC1_DATA3) 32(SDC1_CMD) 33(SDC1_DATA0) 34(VREG_L2_1V8) 35(WLAN_32K_SLE) 36(SDC1_CLK) 42(WIFI3V3_EN) 44(VDD_EXT) 45(GPIO_0) 46(ADC2) 47(ADC1) 48(SD1_DET) 51(NETLIGHT) 53(USIM_DET) 54(FLIGHTMODE) 55(SCL) 56(SDA) 59(AUX_ANT) 66(RTS) 67(CTS) 68(RXD) 69(RI) 70(DCD) 71(TXD) 72(DTR) 73(PCM_OUT) 74(PCM_IN) 75(PCM_SYNC) 76(PCM_CLK) 83(COEX1) 84(COEX2) 85(BOOT_CFG0) 86(COEX3) 87(BOOT_CFG1); U10 C4(RFU1) C6(VPP) C8(RFU2) CD

### Layout directives
differential pair: USB_HOST_N, USB_HOST_P
net class 50 Ohm: ANT_GNSS, ANT_MAIN, NetC36_2, NetC38_2

### Notes on the sheet
- Antennas

### Library data of the parts
C1 C2 C28 C29 C39 C40 = Cap Pol2: Polarized Capacitor (Axial); Published: 8-Jun-2000; LatestRevisionDate: 17-Jul-2002; LatestRevisionNote: Re-released for DXP Platform.; PackageReference: POLAR0.8; Publisher: Altium Limited; PackageDescription: Polarized Capacitor; 2 Leads
  C1 C28 C29 C39 C40: Value: 100uF
  C2: Value: 330uF
C21 C31 C33 C45 = C-X7R-100nF-16V-10%-0603: Capacitor Ceramic X7R 100nF 16V 10% 0603; Tolerance: 10%; Type: X7R; Value: 100nF
C27 C30 = CAP: mpn: C0603C105K8PACTU; E14 pn: 9227776; Value: 1uF
C35 C37 = CMP-16466678-5: CAP CER 10NF 50V 5% X7R 0805; Manufacturer Part Number: 08055C103JAT2A; Capacitance: 1e-08 F; Insulation Resistance: 1e+11 Ω; Voltage Rating (DC): 50.0 V; Dielectric Material: Ceramic Multilayer; Lead-Free Status: Lead Free; Case/Package (SI): 2012; Octopart Url: https://octopart.com/08055c103jat2a-avx+interconnect+%2F+elco-39513106; Capacitance Tolerance: ±5%; OctopartID: 02fac9aacb8edd3d; Number of Pins: 2; Size-Height: 0.00094 m; Size-Width: 0.0012446 m; RoHS: Compliant; REACH SVHC Compliance: No SVHC; Size-Length: 0.0020066 m; Size-Thickness: 0.0009398 m; Case/Package: 0805; Dielectric Characteristic: X7R; Mounting Style: Surface Mount
C36 C38 = 08055C103JAT2A: CAP CER 10NF 50V 5% X7R 0805; Capacitance: 1e-08 F; Insulation Resistance: 1e+11 Ω; Voltage Rating (DC): 50.0 V; Dielectric Material: Ceramic Multilayer; Lead-Free Status: Lead Free; Case/Package (SI): 2012; Octopart Url: https://octopart.com/08055c103jat2a-avx+interconnect+%2F+elco-39513106; Capacitance Tolerance: ±5%; OctopartID: 02fac9aacb8edd3d; Number of Pins: 2; Size-Height: 0.00094 m; Size-Width: 0.0012446 m; RoHS: Compliant; REACH SVHC Compliance: No SVHC; Size-Length: 0.0020066 m; Size-Thickness: 0.0009398 m; Case/Package: 0805; Manufacturer Part Number: 08055C103JAT2A; Dielectric Characteristic: X7R; Mounting Style: Surface Mount
C46-C48 = CAP: CAP CER 33PF 50V C0G/NP0 0603; Manufacturer PN: C0603C330J5GACTU; MANUFACTURER: Kemet
C49 = CAP: CAP CER 0.1UF 16V X7R 0603; Manufacturer PN: C0603C104M4RACTU; MANUFACTURER: Kemet
D1 = D Zener: Zener Diode; MANUFACTURER: Micro Commercial Co; Manufacturer PN: MMSZ5231B-TP; LatestRevisionDate: 17-Jul-2002; LatestRevisionNote: Re-released for DXP Platform.; Publisher: Altium Limited; PackageDescription: Diode, Thru-Hole; 2 Leads; 0.7 in Pin Spacing
D2 D3 = D Zener: Zener Diode; Manufacturer PN: MMSZ5231B-TP; MANUFACTURER: Micro Commercial Co; LatestRevisionDate: 17-Jul-2002; LatestRevisionNote: Re-released for DXP Platform.; Publisher: Altium Limited; PackageDescription: Diode, Thru-Hole; 2 Leads; 0.7 in Pin Spacing
D4 = CMP-924f5b40f9684d88-1: ESDA Series 5 Channel 6.1 V 50 pF SMT Uni Directional Transil Array - SOT-23-6L; Operating Voltage: 6.10 V; Power Rating: 100 W; Breakdown Voltage: 7.20 V; Lead-Free Status: Lead Free; REACH SVHC Compliance: No SVHC; Number of Pins: 6; Case/Package: SOT-23; Size-Width: 1.75 mm; Mounting Style: Surface Mount; Manufacturer Part Number: ESDA6V1-5SC6; Size-Height: 1.45 mm; OctopartID: 924f5b40f9684d88; Size-Length: 3.05 mm; Packaging: Tape & Reel (TR), Cut Tape (CT); Octopart URL: http://octopart.com/esda6v1-5sc6-stmicroelectronics-347713; RoHS: Compliant; Voltage Rating (DC): 6.10 V; Lifecycle Status: Active
F2 = Fuse 1: Fuse; mpn: SSQC 3; Published: 8-Jun-2000; LatestRevisionDate: 17-Jul-2002; LatestRevisionNote: Re-released for DXP Platform.; PackageReference: PIN-W2/E2.8; PackageDescription: Thru-Hole; 2 Leads
FB1 = Fuse 1: Fuse; Manufacturer Part Number: 0ZRM0050FF1E
J1 J2 = U.FL-R-SMT-1(10): RECPT ULTRA-MINI COAX SMD
R4 R23 R25 = Res1: Resistor; Published: 8-Jun-2000; LatestRevisionDate: 17-Jul-2002; LatestRevisionNote: Re-released for DXP Platform.; PackageReference: AXIAL-0.3; Publisher: Altium Limited; PackageDescription: Axial Device, Thru-Hole; 2 Leads; 0.3 in Pin Spacing
  R4: Value: 100K
  R23: Value: 470R
  R25: Value: 47K
R28 R29 = CRCW08050000Z0EAHP: RES SMD 0.0 OHM JUMPER 1/3W 0805; Lead-Free Status: Lead Free; Power Rating: 0.125 W; Resistance: 0.0 Ω; Voltage Rating (DC): 150.0 V; Case/Package: 0805; Number of Pins: 2; Octopart Url: https://octopart.com/crcw08050000z0eahp-vishay-44321084; OctopartID: d14c1ae2bd160e8b; RoHS: Compliant
R31-R33 = Res1: RES SMD 1K OHM 1% 1/10W 0603; Manufacturer: Yageo; Manufacturer PN: RC0603FR-0751RL; Value: 51R; Supplier 1: Digikey
U10 = SIM7100-8-1-15-00-A_revA: Micro SIM Card Connector - Push-Push Type, 8 Pin, SMT, 1.50mm Profile

## Sheet LoRa.SchDoc
size A4
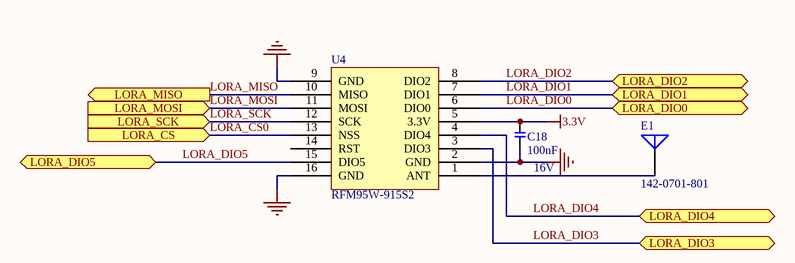
[diagram p5: LoRa.SchDoc]

### Parts
C18  Rating: 16V  [T_CAPC0603X33N]  (hidden comment: 100nF)
E1  142-0701-801  [PIN1]
U4  RFM95W-915S2  [XCVR_RFM95W-915S2]

### Ports
LORA_CS (in), LORA_DIO0 (bidir), LORA_DIO1 (bidir), LORA_DIO2 (bidir), LORA_DIO3 (bidir), LORA_DIO4 (bidir), LORA_DIO5 (bidir), LORA_MISO (out), LORA_MOSI (in), LORA_SCK (in)

### Nets
3.3V: C18.2 U4.5(3.3V)
GND: C18.1 U4.2(GND) U4.9(GND) U4.16(GND)
LORA_CS0: U4.13(NSS) ; port LORA_CS  [project net LORA_CS]
LORA_DIO0: U4.6(DIO0) ; port LORA_DIO0
LORA_DIO1: U4.7(DIO1) ; port LORA_DIO1
LORA_DIO2: U4.8(DIO2) ; port LORA_DIO2
LORA_DIO3: U4.3(DIO3) ; port LORA_DIO3
LORA_DIO4: U4.4(DIO4) ; port LORA_DIO4
LORA_DIO5: U4.15(DIO5) ; port LORA_DIO5
LORA_MISO: U4.10(MISO) ; port LORA_MISO
LORA_MOSI: U4.11(MOSI) ; port LORA_MOSI
LORA_SCK: U4.12(SCK) ; port LORA_SCK
NetE1_1: E1.1(A) U4.1(ANT)

Not connected (* = marked no-connect by the designer): U4 14(RST)

### Library data of the parts
C18 = C-X7R-100nF-16V-10%-0603: Capacitor Ceramic X7R 100nF 16V 10% 0603; Tolerance: 10%; Type: X7R; Value: 100nF
E1 = Antenna: Generic Antenna; Published: 24-Mar-1999; LatestRevisionDate: 17-Jul-2002; LatestRevisionNote: Re-released for DXP Platform.; PackageReference: PIN1; Publisher: Altium Limited
U4 = RFM95

## Sheet Other.SchDoc: Iris
size A3; Organization: Toradex AG; Address1: Altsagenstrasse 5; Address2: Horw; Address3: 6048; Address4: Switzerland; DocumentNumber: 13; Revision: V2.0; SheetNumber: 13; SheetTotal: 16
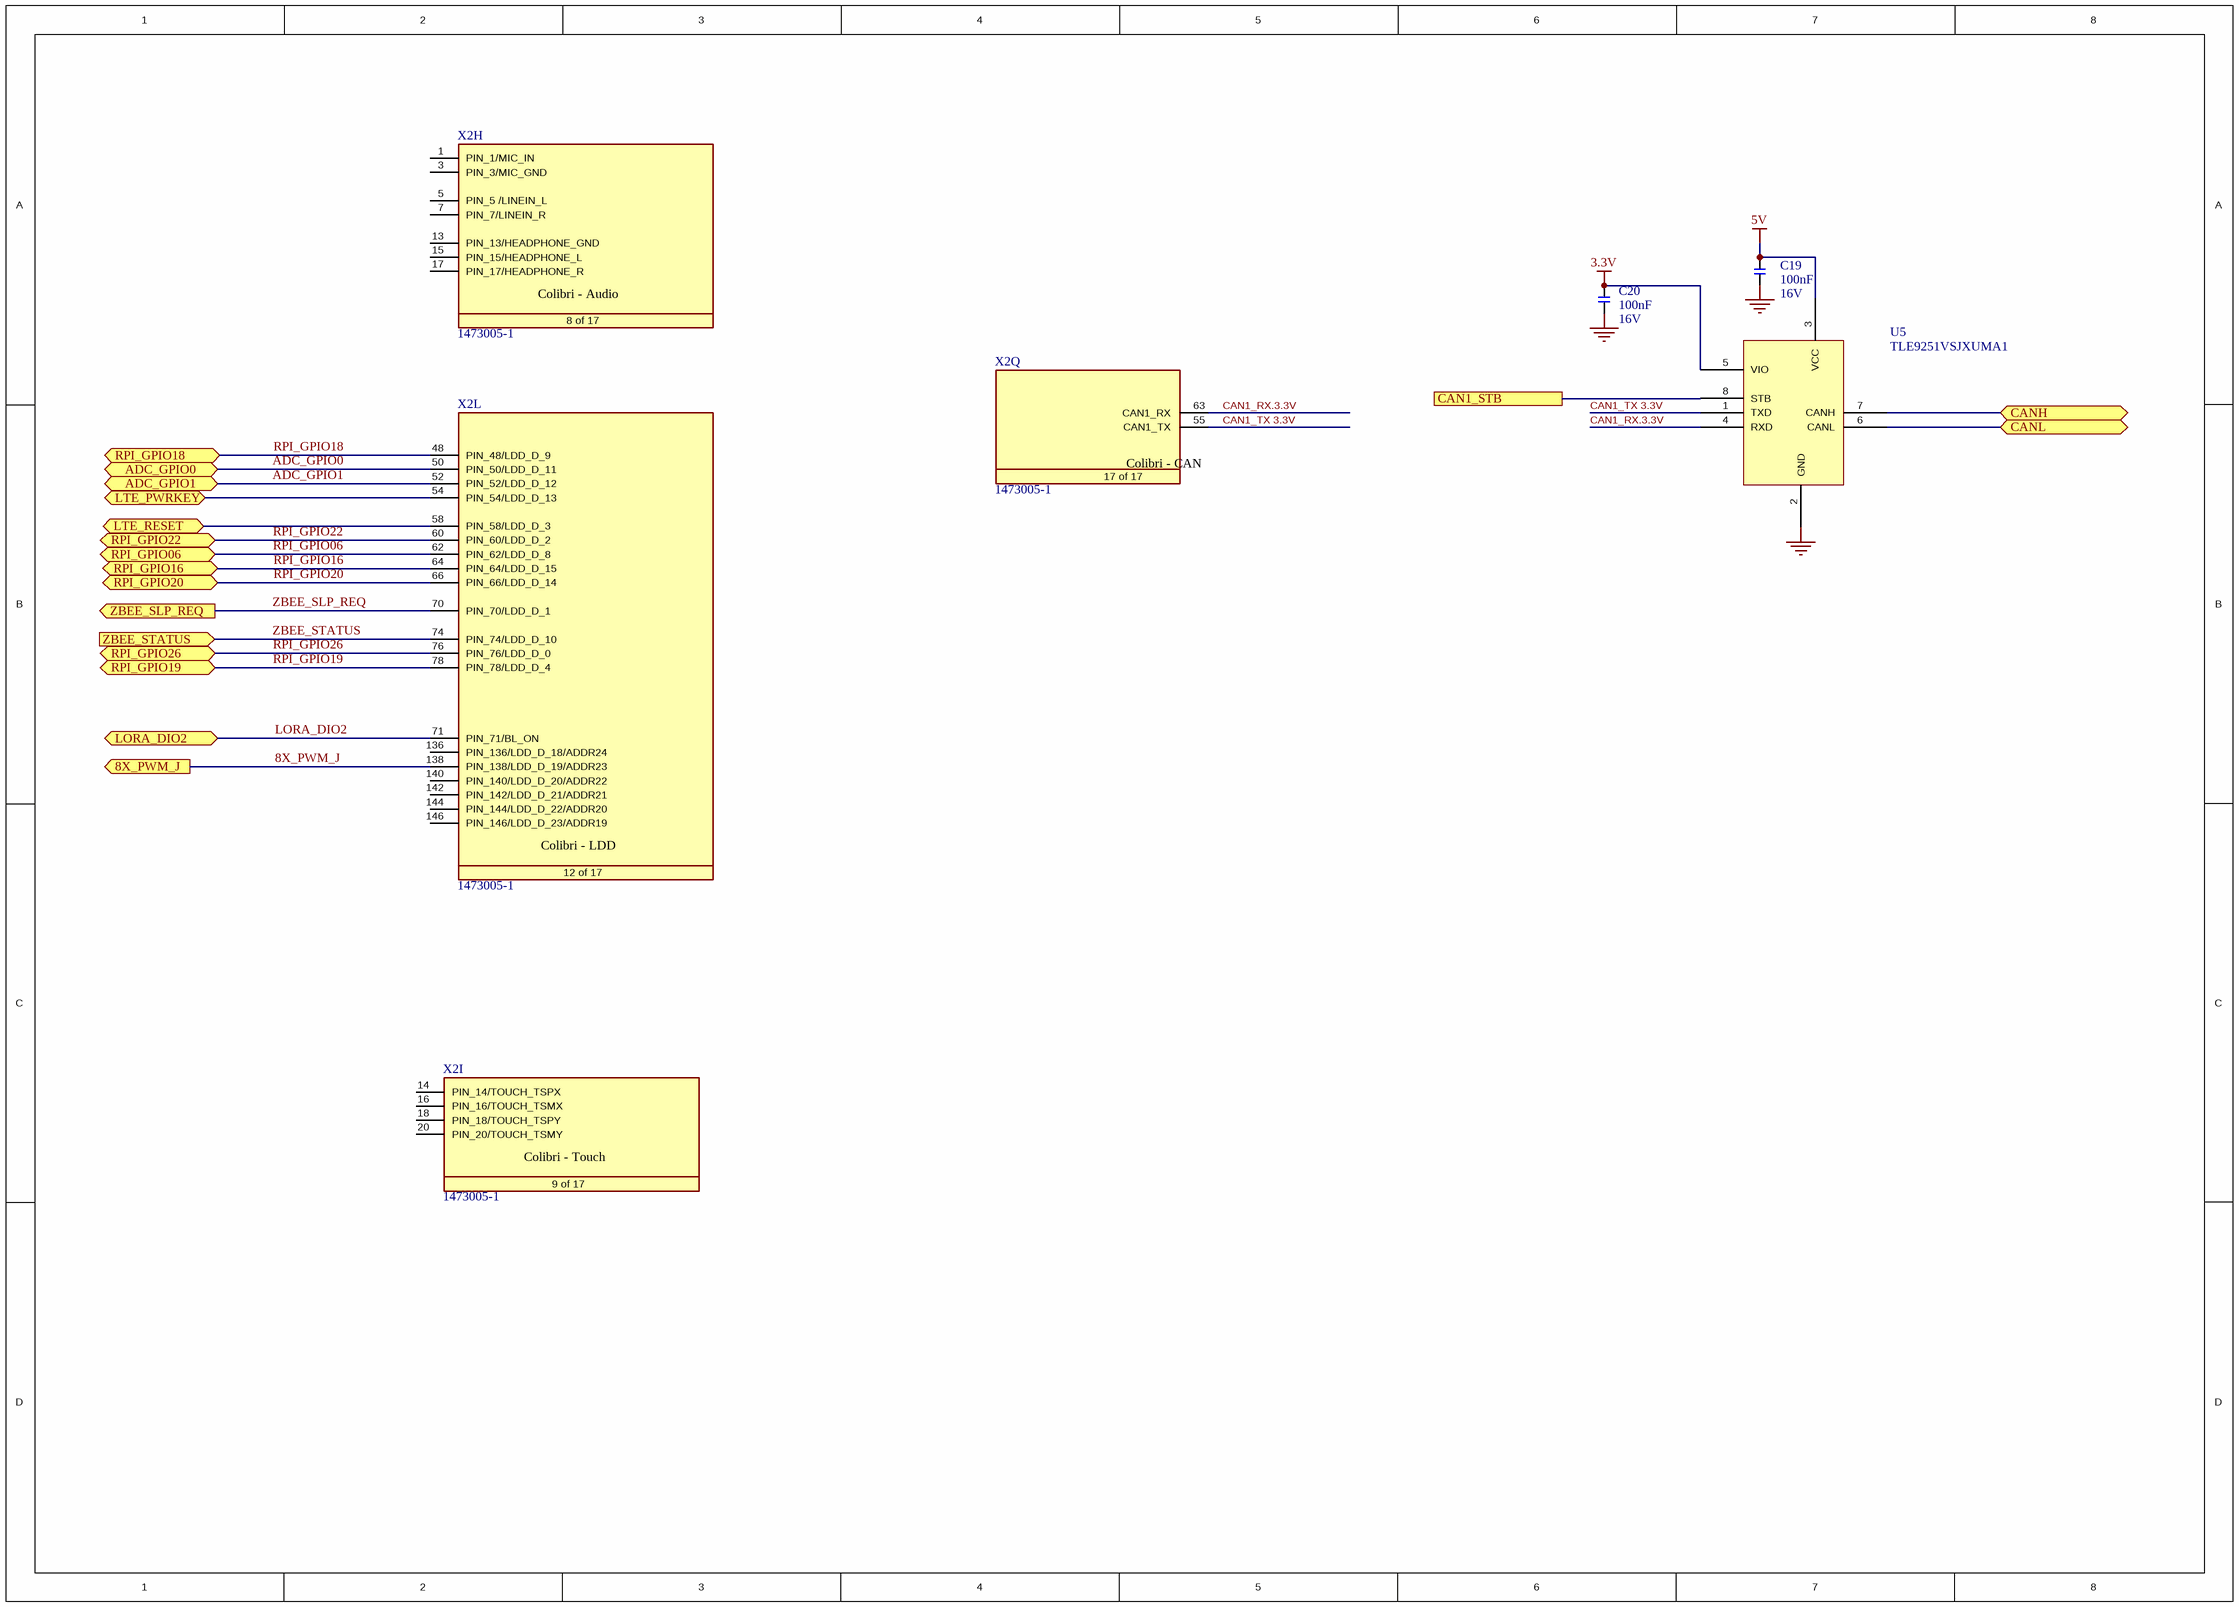
[diagram p6: Other.SchDoc]

### Parts
C19  Rating: 16V  [T_CAPC0603X33N]  (hidden comment: 100nF)
C20  Rating: 16V  [T_CAPC0603X33N]  (hidden comment: 100nF)
U5  TLE9251VSJXUMA1  [SOIC127P602X173-8N]
X2  1473005-1  [T_Tyco_1473005-1]  (parts H,I,L,Q of 17)

### Ports
8X_PWM_J (out), ADC_GPIO0 (bidir), ADC_GPIO1 (bidir), CAN1_STB, CANH (bidir), CANL (bidir), LORA_DIO2 (bidir), LTE_PWRKEY (bidir), LTE_RESET (bidir), RPI_GPIO06 (bidir), RPI_GPIO16 (bidir), RPI_GPIO18 (bidir), RPI_GPIO19 (bidir), RPI_GPIO20 (bidir), RPI_GPIO22 (bidir), RPI_GPIO26 (bidir), ZBEE_SLP_REQ (out), ZBEE_STATUS (in)

### Nets
3.3V: C20.2 U5.5(VIO)
5V: C19.2 U5.3(VCC)
GND: C19.1 C20.1 U5.2(GND)
8X_PWM_J: X2.138(PIN_138/LDD_D_19/ADDR23) ; port 8X_PWM_J
ADC_GPIO0: X2.50(PIN_50/LDD_D_11) ; port ADC_GPIO0
ADC_GPIO1: X2.52(PIN_52/LDD_D_12) ; port ADC_GPIO1
CAN1_RX.3.3V: U5.4(RXD) X2.63(CAN1_RX)
CAN1_STB: U5.8(STB) ; port CAN1_STB
CAN1_TX 3.3V: U5.1(TXD) X2.55(CAN1_TX)
CANH: U5.7(CANH) ; port CANH
CANL: U5.6(CANL) ; port CANL
LORA_DIO2: X2.71(PIN_71/BL_ON) ; port LORA_DIO2
LTE_PWRKEY: X2.54(PIN_54/LDD_D_13) ; port LTE_PWRKEY
LTE_RESET: X2.58(PIN_58/LDD_D_3) ; port LTE_RESET
RPI_GPIO06: X2.62(PIN_62/LDD_D_8) ; port RPI_GPIO06
RPI_GPIO16: X2.64(PIN_64/LDD_D_15) ; port RPI_GPIO16
RPI_GPIO18: X2.48(PIN_48/LDD_D_9) ; port RPI_GPIO18
RPI_GPIO19: X2.78(PIN_78/LDD_D_4) ; port RPI_GPIO19
RPI_GPIO20: X2.66(PIN_66/LDD_D_14) ; port RPI_GPIO20
RPI_GPIO22: X2.60(PIN_60/LDD_D_2) ; port RPI_GPIO22
RPI_GPIO26: X2.76(PIN_76/LDD_D_0) ; port RPI_GPIO26
ZBEE_SLP_REQ: X2.70(PIN_70/LDD_D_1) ; port ZBEE_SLP_REQ
ZBEE_STATUS: X2.74(PIN_74/LDD_D_10) ; port ZBEE_STATUS

Not connected (* = marked no-connect by the designer): X2 1(PIN_1/MIC_IN) 3(PIN_3/MIC_GND) 5(PIN_5_/LINEIN_L) 7(PIN_7/LINEIN_R) 13(PIN_13/HEADPHONE_GND) 14(PIN_14/TOUCH_TSPX) 15(PIN_15/HEADPHONE_L) 16(PIN_16/TOUCH_TSMX) 17(PIN_17/HEADPHONE_R) 18(PIN_18/TOUCH_TSPY) 20(PIN_20/TOUCH_TSMY) 136(PIN_136/LDD_D_18/ADDR24) 140(PIN_140/LDD_D_20/ADDR22) 142(PIN_142/LDD_D_21/ADDR21) 144(PIN_144/LDD_D_22/ADDR20) 146(PIN_146/LDD_D_23/ADDR19)

### Notes on the sheet
- Title
- Size:
- Date:
- A3
- Number:
- Time:
- Revision:
- Sheet
- of
- File:
- (in symbol CON-Tyco-1473005-1-200-0.6mm, part H) Colibri - Audio; 8 of 17
- (in symbol CON-Tyco-1473005-1-200-0.6mm, part I) Colibri - Touch; 9 of 17
- (in symbol CON-Tyco-1473005-1-200-0.6mm, part L) Colibri - LDD; 12 of 17
- (in symbol CON-Tyco-1473005-1-200-0.6mm, part Q) Colibri - CAN; 17 of 17

### Library data of the parts
C19 C20 = C-X7R-100nF-16V-10%-0603: Capacitor Ceramic X7R 100nF 16V 10% 0603; Tolerance: 10%; Type: X7R; Value: 100nF
X2 = CON-Tyco-1473005-1-200-0.6mm: as X2 on sheet Colibri; Manufacturer Part No.: 1473005-1

## Sheet PowerSupply.SchDoc: Iris
size A3; Organization: Toradex AG; Address1: Altsagenstrasse 5; Address2: Horw; Address3: 6048; Address4: Switzerland; DocumentNumber: 3; Revision: V2.0; SheetNumber: 3; SheetTotal: 16
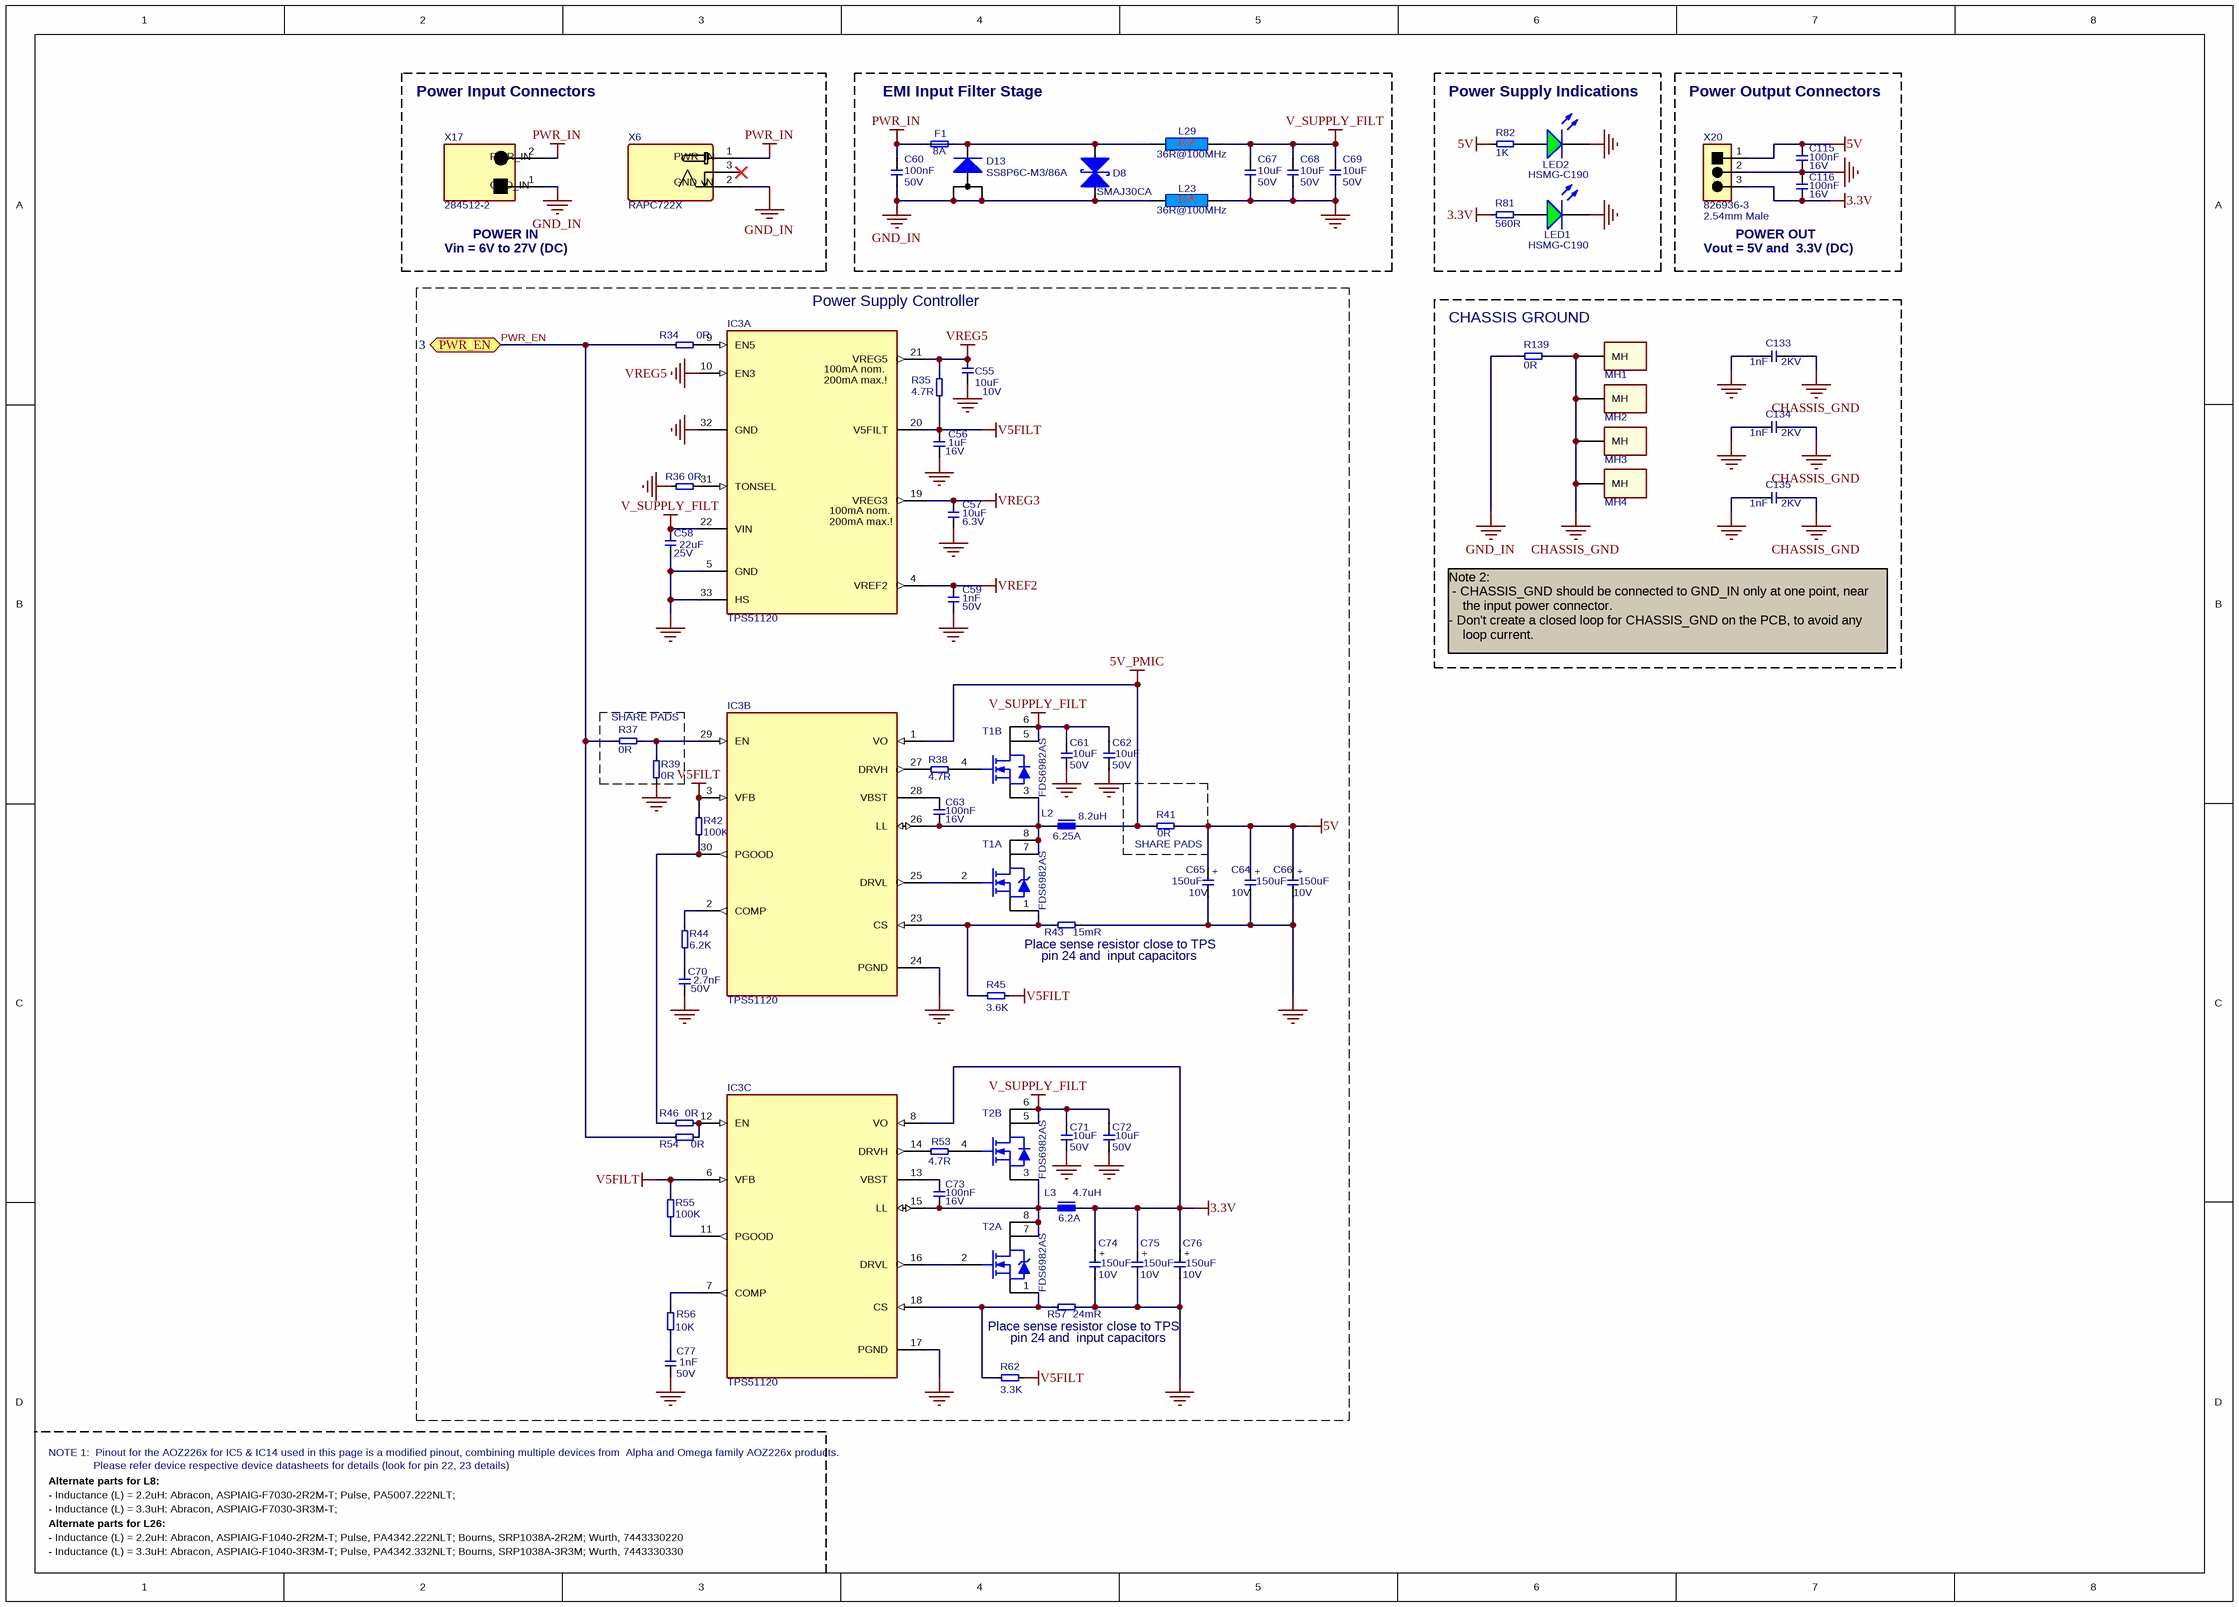
[diagram p7: PowerSupply.SchDoc]

### Parts
C55  Rating: 10V  [T_CAPC0805X125N]  (hidden comment: 10uF)
C56  Rating: 16V  [T_CAPC0603X33N]  (hidden comment: 1uF)
C57  Rating: 6.3V  [T_CAPC0603X33N]  (hidden comment: 10uF)
C58  Rating: 25V  [CAPC3225X160N]  (hidden comment: 22uF)
C59  Rating: 50V  [T_CAPC0603X33N]  (hidden comment: 1nF)
C60  Rating: 50V  [T_CAPC0603X33N]  (hidden comment: 100nF)
C61  Rating: 50V  [CAPC3225X160N]  (hidden comment: 10uF)
C62  Rating: 50V  [CAPC3225X160N]  (hidden comment: 10uF)
C63  Rating: 16V  [T_CAPC0603X33N]  (hidden comment: 100nF)
C64  Rating: 10V  [CAPMP7343X310N]  (hidden comment: 150uF)
C65  Rating: 10V  [CAPMP7343X310N]  (hidden comment: 150uF)
C66  Rating: 10V  [CAPMP7343X310N]  (hidden comment: 150uF)
C67  Rating: 50V  [CAPC3225X160N]  (hidden comment: 10uF)
C68  Rating: 50V  [CAPC3225X160N]  (hidden comment: 10uF)
C69  Rating: 50V  [CAPC3225X160N]  (hidden comment: 10uF)
C70  Rating: 50V  [CAPC1005X60N]  (hidden comment: 2.7nF)
C71  Rating: 50V  [CAPC3225X160N]  (hidden comment: 10uF)
C72  Rating: 50V  [CAPC3225X160N]  (hidden comment: 10uF)
C73  Rating: 16V  [T_CAPC0603X33N]  (hidden comment: 100nF)
C74  Rating: 10V  [CAPMP7343X310N]  (hidden comment: 150uF)
C75  Rating: 10V  [CAPMP7343X310N]  (hidden comment: 150uF)
C76  Rating: 10V  [CAPMP7343X310N]  (hidden comment: 150uF)
C77  Rating: 50V  [T_CAPC0603X33N]  (hidden comment: 1nF)
C115  Rating: 16V  [CAPC1005X60N]  (hidden comment: 100nF)
C116  Rating: 16V  [CAPC1005X60N]  (hidden comment: 100nF)
C133  Rating: 2KV  [T_CAPC1206X180N]  (hidden comment: 1nF)
C134  Rating: 2KV  [T_CAPC1206X180N]  (hidden comment: 1nF)
C135  Rating: 2KV  [T_CAPC1206X180N]  (hidden comment: 1nF)
D8  Manufacturer Part No.: SMAJ30CA  [T_LITTLEFUSE_SMAJ30CA]  (hidden comment: D-Littelfuse-SMAJ30CA-Schottky)
D13  SS8P6C-M3/86A  [T_DIOM_TO277A]
F1  8A  [T_Littelfuse_0458]
IC3  TPS51120  [QFN50P500X500X100-33N]  (parts A,B,C of 3)
L2  Rating: 6.25A  [T_INDM120120X80N]  (hidden comment: 8.2uH)
L3  Rating: 6.2A  [T_INDM102102X45N]  (hidden comment: 4.7uH)
L23  36R@100MHz  [T_Laird_35F0121-0SR-10]
L29  36R@100MHz  [T_Laird_35F0121-0SR-10]
LED1  Manufacturer Part No.: HSMG-C190  [LEDC1608X80N]  (hidden comment: LED)
LED2  Manufacturer Part No.: HSMG-C190  [LEDC1608X80N]  (hidden comment: LED)
MH1  MECH-MountingHoles  [T_MountingHoles]  (value not drawn)  (no BOM)
MH2  MECH-MountingHoles  [T_MountingHoles]  (value not drawn)  (no BOM)
MH3  MECH-MountingHoles  [T_MountingHoles]  (value not drawn)  (no BOM)
MH4  MECH-MountingHoles  [T_MountingHoles]  (value not drawn)  (no BOM)
R34  0R  [T_RESC0603X30N]
R35  4.7R  [RESC1005X40N]
R36  0R  [T_RESC0603X30N]
R37  0R  [T_RESC3216X760N]
R38  4.7R  [RESC1005X40N]
R39  0R  [T_RESC3216X760N]
R41  0R  [CAPC1608X100N]
R42  100K  [T_RESC0603X30N]
R43  15mR  [RESC3316X76N]
R44  6.2K  [RESC1005X40N]
R45  3.6K  [T_RESC0603X30N]
R46  0R  [T_RESC0603X30N]
R53  4.7R  [RESC1005X40N]
R54  0R  [T_RESC0603X30N]
R55  100K  [T_RESC0603X30N]
R56  10K  [RESC1005X40N]
R57  24mR  [RESC3316X76N]
R62  3.3K  [T_RESC0603X30N]
R81  560R  [RESC1005X40N]
R82  1K  [RESC1005X40N]
R139  0R  [T_RESC3216X760N]
T1  FDS6982AS  [SOIC127P600X173-8N]  (parts A,B of 2)
T2  FDS6982AS  [SOIC127P600X173-8N]  (parts A,B of 2)
X6  RAPC722X  [CTBP9358/3]
X17  284512-2  [T_TYCO_284512-2]
X20  826936-3  [T_TYCO_826936-3]

### Blocks framed on the sheet
Power Input Connectors: X6 X17
EMI Input Filter Stage: C60 C67-C69 D8 D13 F1 L23 L29
Power Supply Indications: LED1 LED2 R81 R82
Power Output Connectors: C115 C116 X20
Power Supply Controller: C55-C59 C61-C66 C70-C77 IC3 L2 L3 R34-R36 R38 R42-R46 R53-R57 R62 T1 T2
CHASSIS GROUND: C133-C135 MH1-MH4 R139
SHARE PADS: R37 R39
SHARE PADS: R41

### Ports
PWR_EN (bidir, see 3)

### Nets
3.3V: C74.1 C75.1 C76.1 C116.1 IC3.8(VO) L3.2 R81.2 X20.3
5V: C64.1 C65.1 C66.1 C115.2 R41.2 R82.2 X20.1
5V_PMIC: IC3.1(VO) L2.2 R41.1
CHASSIS_GND: C133.1 C134.1 C135.1 MH1.1(MH) MH2.1(MH) MH3.1(MH) MH4.1(MH) R139.2
GND: C55.1 C56.1 C57.1 C58.1 C59.1 C61.1 C62.1 C64.2 C65.2 C66.2 C67.1 C68.1 C69.1 C70.1 C71.1 C72.1 C74.2 C75.2 C76.2 C77.1 C115.1 C116.2 C133.2 C134.2 C135.2 IC3.5(GND) IC3.17(PGND) IC3.24(PGND) IC3.32(GND) IC3.33(HS) L23.2 LED1.1(K) LED2.1(K) R36.1 R39.1 R43.2 R57.2 X20.2
GND_IN: C60.1 D8.2(Anode) D13.A1 D13.A2 L23.1 R139.1 X6.2(PWR_IN) X17.1(GND_IN)
PWR_IN: C60.2 F1.1 X6.1(GND_IN) X17.2(PWR_IN)
V5FILT: C56.2 IC3.3(VFB) IC3.6(VFB) IC3.20(V5FILT) R35.1 R42.2 R45.2 R55.2 R62.2
V_SUPPLY_FILT: C58.2 C61.2 C62.2 C67.2 C68.2 C69.2 C71.2 C72.2 IC3.22(VIN) L29.2 T1.5(D) T1.6(D) T2.5(D) T2.6(D)
VREF2: C59.2 IC3.4(VREF2)
VREG3: C57.2 IC3.19(VREG3)
VREG5: C55.2 IC3.10(EN3) IC3.21(VREG5) R35.2
PWR_EN: R34.1 R37.1 R54.1 ; port PWR_EN
NetC63_1: C63.1 IC3.26(LL) L2.1 T1.3(S) T1.7(D) T1.8(D)
NetC63_2: C63.2 IC3.28(VBST)
NetC70_2: C70.2 R44.1
NetC73_1: C73.1 IC3.15(LL) L3.1 T2.3(S) T2.7(D) T2.8(D)
NetC73_2: C73.2 IC3.13(VBST)
NetC77_2: C77.2 R56.1
NetD8_1: D8.1(Cathode) D13.K F1.2 L29.1
NetIC3_2: IC3.2(COMP) R44.2
NetIC3_7: IC3.7(COMP) R56.2
NetIC3_9: IC3.9(EN5) R34.2
NetIC3_11: IC3.11(PGOOD) R55.1
NetIC3_12: IC3.12(EN) R46.2 R54.2
NetIC3_14: IC3.14(DRVH) R53.1
NetIC3_16: IC3.16(DRVL) T2.2(G)
NetIC3_18: IC3.18(CS) R57.1 R62.1 T2.1(S)
NetIC3_23: IC3.23(CS) R43.1 R45.1 T1.1(S)
NetIC3_25: IC3.25(DRVL) T1.2(G)
NetIC3_27: IC3.27(DRVH) R38.1
NetIC3_29: IC3.29(EN) R37.2 R39.2
NetIC3_30: IC3.30(PGOOD) R42.1 R46.1
NetIC3_31: IC3.31(TONSEL) R36.2
NetLED1_2: LED1.2(A) R81.1
NetLED2_2: LED2.2(A) R82.1
NetR38_2: R38.2 T1.4(G)
NetR53_2: R53.2 T2.4(G)

Not connected (* = marked no-connect by the designer): X6 3(PWR_IN)*

### Notes on the sheet
- (near X17) Vin = 6V to 27V (DC)
- (near X17) POWER IN
- Vout = 5V and  3.3V (DC)
- (near X20) 2.54mm Male
- POWER OUT
- Note 2:
  - CHASSIS_GND should be connected to GND_IN only at one point, near
  the input power connector.
  - Don't create a closed loop for CHASSIS_GND on the PCB, to avoid any
  loop current.
- (near R43) Place sense resistor close to TPS
- (near R43) pin 24 and  input capacitors
- (near R57) Place sense resistor close to TPS
- pin 24 and  input capacitors
- NOTE 1:  Pinout for the AOZ226x for IC5 & IC14 used in this page is a modified pinout, combining multiple devices from  Alpha and Omega family AOZ226x products.
- Alternate parts for L8:
- Please refer device respective device datasheets for details (look for pin 22, 23 details)
- Alternate parts for L26:
- - Inductance (L) = 3.3uH: Abracon, ASPIAIG-F1040-3R3M-T; Pulse, PA4342.332NLT; Bourns, SRP1038A-3R3M; Wurth, 7443330330
- - Inductance (L) = 2.2uH: Abracon, ASPIAIG-F1040-2R2M-T; Pulse, PA4342.222NLT; Bourns, SRP1038A-2R2M; Wurth, 7443330220
- - Inductance (L) = 3.3uH: Abracon, ASPIAIG-F7030-3R3M-T;
- - Inductance (L) = 2.2uH: Abracon, ASPIAIG-F7030-2R2M-T; Pulse, PA5007.222NLT;
- Title
- Size:
- Date:
- A3
- Number:
- Time:
- Revision:
- Sheet
- of
- File:
- (in symbol C-TA-150uF-10V-10%-7343) +
- (in symbol IC-TI-TPS51120, part A) 100mA nom.; 200mA max.!

### Library data of the parts
C55 = C-X5R-10uF-10V-20%-0805: Capacitor Ceramic X5R 10uF 10V 20% 0805; Tolerance: 20%; Type: X5R; Value: 10uF
C56 = C-X5R-1uF-16V-20%-0603: Capacitor Ceramic X5R 1uF 16V 20% 0603; Tolerance: 20%; Type: X5R; Value: 1uF
C57 = C-X5R-10uF-6.3V-20%-0603: Capacitor Ceramic X5R 10uF 6.3V 20% 0603; Tolerance: 20%; Type: X5R; Value: 10uF
C58 = C-X5R-22uF-25V-20%-1210: Capacitor Ceramic X5R 22uF 25V 20% 1210; Tolerance: 20%; Type: X5R; Value: 22uF
C59 C77 = C-X7R-1nF-50V-10%-0603: Capacitor Ceramic X7R 1nF 50V 10% 0603; Tolerance: 10%; Type: X7R; Value: 1nF
C60 = C-X7R-100nF-50V-10%-0603: Capacitor Ceramic X7R 100nF 50V 10% 0603; Tolerance: 10%; Type: X7R; Value: 100nF
C61 C62 C71 C72 = C-X5R-10uF-50V-20%-1210: Capacitor Ceramic X5R 10uF 50V 20% 1210; Tolerance: 20%; Type: X5R; Value: 10uF
C63 C73 = C-X7R-100nF-16V-10%-0603: Capacitor Ceramic X7R 100nF 16V 10% 0603; Tolerance: 10%; Type: X7R; Value: 100nF
C64-C66 C74-C76 = C-TA-150uF-10V-10%-7343: Capacitor TA 150uF 10V 20% 7343; Tolerance: 10%; Type: TA; Value: 150uF
C67-C69 = C-X5R-10uF-50V-10%-1210: Capacitor Ceramic X5R 10uF 50V 10% 1210; Tolerance: 10%; Type: X5R; Value: 10uF
C70 = C-X7R-2.7nF-50V-10%-0402: Capacitor Ceramic X7R 2.7nF 50V 10% 0402; Tolerance: 10%; Type: X7R; Value: 2.7nF
C115 C116 = C-X7R-100nF-16V-10%-0402: Capacitor Ceramic X7R 100nF 16V 10% 0402; Tolerance: 10%; Type: X7R; Value: 100nF
C133-C135 = C-X7R-1nF-2KV-10%-1206: Capacitor Ceramic X7R 1nF 2KV 10% 1206; Tolerance: 10%; Type: X7R; Value: 1nF
D8 = D-Littelfuse-SMAJ30CA-Schottky: Bidirectional ESD protection; Manufacturer Name: Littelfuse
D13 = D-Vishay-SS8P6C-M3/86A: Diode Schottky, SS8P6C-M3/86A, 60V(Vrrm), 8A(If); Manufacturer: Vishay; Manufacturer Part Number: SS8P6C-M3/86A
F1 = F-Littelfuse-0458008.DR: Fast Fuse, Rated 8A, 63V(DC), 1206 (3216 Metric); Manufacturer Part No.: 0458008.DR; Manufacturer Name: Littelfuse; Value: 8A
IC3 = IC-TI-TPS51120: Power Supply Controller; Manufacturer Name: Texas Instruments; Manufacturer Part No.: TPS51120
L2 = L-Wurth-744771008-8.2uH-6.25A-20%: Inductance 8.2uH 6.25A 20%; Manufacturer Name: Wurth; Tolerance: 20%; Manufacturer Part No.: 744771008; Value: 8.2uH
L3 = L-Wurth-7447797470-4.7uH-6.2A-20%: Inductance 4.7uH 6.2A 20%; Manufacturer Name: Wurth; Tolerance: 20%; Manufacturer Part No.: 7447797470; Value: 4.7uH
L23 L29 = L-Laird-35F0121-0SR-10-10A-25%: Power Supply FB 10A; Tolerance: 25%; Rating: 10A; Value: 36R@100MHz
LED1 LED2 = LED-Avago-HSMG-C190: Surface mount LED green 20mA; Manufacturer Name: Avago
MH1-MH4 = MECH-MountingHoles: PCB Mounting Holes, hole diemeter = 3.2mm, pad diameter = 6.2mm
R34 R36 R46 R54 = R-0R-63mW-1%-0603: Resistor 0 ohm 63mW 1% 0603; Rating: 63mW; Tolerance: 1%; Value: 0R
R35 R38 R53 = R-4.7R-63mW-5%-0402: Resistor 4.7 ohm 63mW 5% 0402; Rating: 63mW; Tolerance: 5%; Value: 4.7R
R37 R39 R139 = R-0R-63mW-1%-1206: Resistor 0 ohm 63mW 1% 1206; Rating: 63mW; Tolerance: 1%; Value: 0R
R41 = R-0R-63mW-1%-1210: Resistor 0 ohm 63mW 1%; Rating: 63mW; Tolerance: 1%; Value: 0R
R42 R55 = R-100KR-63mW-5%-0603: Resistor 100 Kohm 63mW 5% 0603; Value: 100KR; Rating: 63mW; Tolerance: 5%
R43 = R-15mR-250mW-1%-1206: Resistor 15 mohm 250mW 1% 1206; Rating: 250mW; Tolerance: 1%; Value: 15mR
R44 = R-6.2KR-63mW-1%-0402: Resistor 6.2 Kohm 63mW 1% 0402; Value: 6.2KR; Rating: 63mW; Tolerance: 1%
R45 = R-3.6KR-63mW-1%-0603: Resistor 3.6 Kohm 63mW 1% 0603; Value: 3.6KR; Rating: 63mW; Tolerance: 1%
R56 = R-10KR-63mW-1%-0402: as R19 on sheet Colibri; Rating: 63mW; Tolerance: 1%
R57 = R-24mR-250mW-1%-1206: Resistor 24 mohm 250mW 1% 1206; Rating: 250mW; Tolerance: 1%; Value: 24mR
R62 = R-3.3KR-63mW-1%-0603: Resistor 3.3 Kohm 63mW 1% 0603; Value: 3.3KR; Rating: 63mW; Tolerance: 1%
R81 = R-560R-63mW-5%-0402: Resistor 560 ohm 63mW 5% 0402; Rating: 63mW; Tolerance: 5%; Value: 560R
R82 = R-1KR-63mW-5%-0402: Resistor 1 Kohm 63mW 5% 0402; Rating: 63mW; Tolerance: 5%; Value: 1K
T1 T2 = T-Fairchild-FDS6982AS-N: N-Channel PowerTrench SyncFET; Manufacturer Name: Fairchild; Manufacturer Part No.: FDS6982AS
X6 = CON-SwitchCraft-RAPC722X: Barrel Power Connector; Manufacturer Part No.: RAPC722X; Manufacturer Name: SwitchCraft
X17 = CON-Tyco-284512-2-1x2-3.5mm: Terminal Block Power Connector; Manufacturer Name: Tyco; No. of ways: 1x2; Pitch: 3.5mm; Manufacturer Part No.: 284512-2
X20 = CON-Tyco-826936-3-1X3-2.54mm: Header, 3-Pin; Manufacturer Name: Tyco; No. of ways: 1X3; Pitch: 2.54mm; Manufacturer Part No.: 826936-3

## Sheet SDCard.SchDoc: Iris
size A3; Organization: Toradex AG; Address1: Altsagenstrasse 5; Address2: Horw; Address3: 6048; Address4: Switzerland; DocumentNumber: 7; Revision: V2.0; SheetNumber: 7; SheetTotal: 16
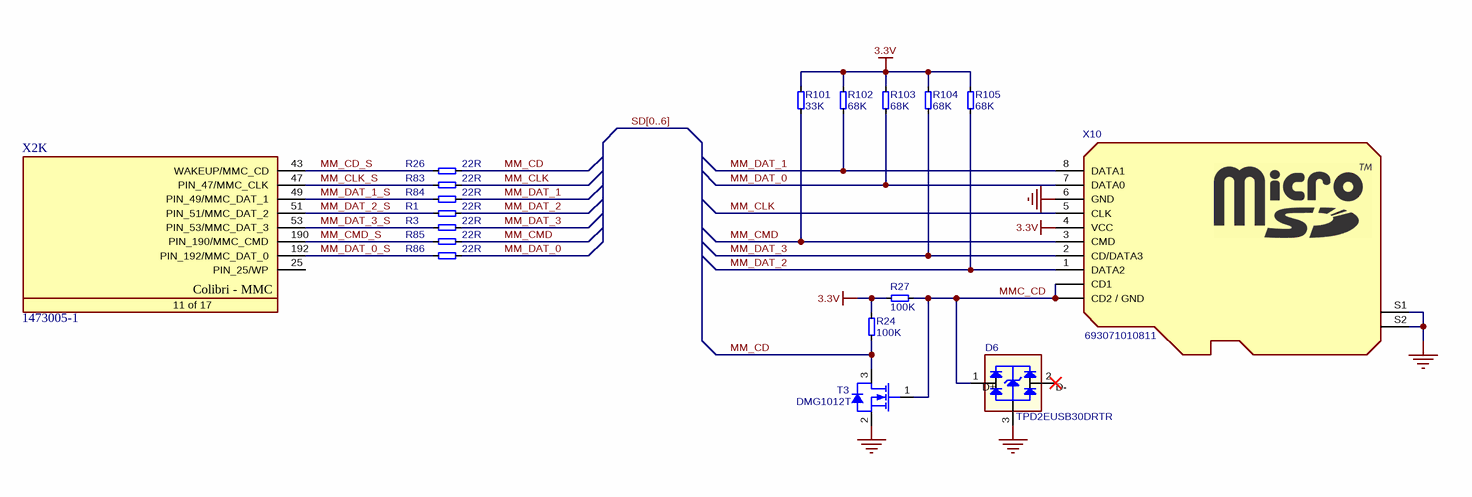
[diagram p8: SDCard.SchDoc]

### Parts
D6  TPD2EUSB30DRTR  [T_TI_TPD2EUSB30DRTR]
R1  22R  [RESC1005X40N]
R3  22R  [RESC1005X40N]
R24  100K  [T_RESC0603X30N]
R26  22R  [RESC1005X40N]
R27  100K  [T_RESC0603X30N]
R83  22R  [RESC1005X40N]
R84  22R  [RESC1005X40N]
R85  22R  [RESC1005X40N]
R86  22R  [RESC1005X40N]
R101  33K  [RESC1005X40N]
R102  68K  [RESC1005X40N]
R103  68K  [RESC1005X40N]
R104  68K  [RESC1005X40N]
R105  68K  [RESC1005X40N]
T3  Manufacturer Part No.: DMG1012T  [T_SOT50P160X80-3N]  (hidden comment: T-DiodeInc-DMG1012T)
X2  1473005-1  [T_Tyco_1473005-1]  (part K of 17)
X10  Manufacturer Part No.: 693071010811  [T_Wurth_693071010811]  (hidden comment: MicroSD Holder)

### Nets
3.3V: R24.2 R27.2 R101.2 R102.2 R103.2 R104.2 R105.2 X10.4(VCC)
GND: D6.3 T3.2(S) X10.6(GND) X10.S1(S) X10.S2(S)
MM_CD: R24.1 R26.2 T3.3(D)
MM_CD_S: R26.1 X2.43(WAKEUP/MMC_CD)
MM_CLK: R83.2 X10.5(CLK)
MM_CLK_S: R83.1 X2.47(PIN_47/MMC_CLK)
MM_CMD: R85.2 R101.1 X10.3(CMD)
MM_CMD_S: R85.1 X2.190(PIN_190/MMC_CMD)
MM_DAT_0: R86.2 R103.1 X10.7(DATA0)
MM_DAT_0_S: R86.1 X2.192(PIN_192/MMC_DAT_0)
MM_DAT_1: R84.2 R102.1 X10.8(DATA1)
MM_DAT_1_S: R84.1 X2.49(PIN_49/MMC_DAT_1)
MM_DAT_2: R1.2 R105.1 X10.1(DATA2)
MM_DAT_2_S: R1.1 X2.51(PIN_51/MMC_DAT_2)
MM_DAT_3: R3.2 R104.1 X10.2(CD/DATA3)
MM_DAT_3_S: R3.1 X2.53(PIN_53/MMC_DAT_3)
MMC_CD: D6.1(D+) R27.1 T3.1(G) X10.CD1 X10.CD2(CD2_/_GND)

Not connected (* = marked no-connect by the designer): D6 2(D-)*; X2 25(PIN_25/WP)

### Buses and harness runs
bus SD[0..6]

### Notes on the sheet
- Title
- Size:
- Date:
- A3
- Number:
- Time:
- Revision:
- Sheet
- of
- File:
- (in symbol CON-Tyco-1473005-1-200-0.6mm, part K) Colibri - MMC; 11 of 17

### Library data of the parts
D6 = D-TI-TPD2EUSB30DRTR: 2 Channel Protection for Super Speed USB3.0; Manufacturer Name: TI; Manufacturer Part No.: TPD2EUSB30DRTR
R1 R3 R26 R83-R86 = R-22R-63mW-5%-0402: Resistor 22 ohm 63mW 5% 0402; Rating: 63mW; Tolerance: 5%; Value: 22R
R24 R27 = R-100KR-63mW-5%-0603: as R42 on sheet PowerSupply; Rating: 63mW; Tolerance: 5%
R101 = R-33KR-63mW-5%-0402: Resistor 33 Kohm 63mW 5% 0402; Value: 33KR; Rating: 63mW; Tolerance: 5%
R102-R105 = R-68KR-63mW-5%-0402: Resistor 68 Kohm 63mW 5% 0402; Value: 68KR; Rating: 63mW; Tolerance: 5%
T3 = T-DiodeInc-DMG1012T: N-Channel 20V (D-S)  MOSFET; Manufacturer Name: Diode Inc
X2 = CON-Tyco-1473005-1-200-0.6mm: as X2 on sheet Colibri; Manufacturer Part No.: 1473005-1
X10 = CON-Wurth-693071010811: Micro SD Holder Push Push CD; Manufacturer Name: Wurth; No. of ways: 9

## Sheet Serial.SchDoc: Iris
size A3; Organization: Toradex AG; Address1: Altsagenstrasse 5; Address2: Horw; Address3: 6048; Address4: Switzerland; DocumentNumber: 14; Revision: V2.0; SheetNumber: 14; SheetTotal: 16
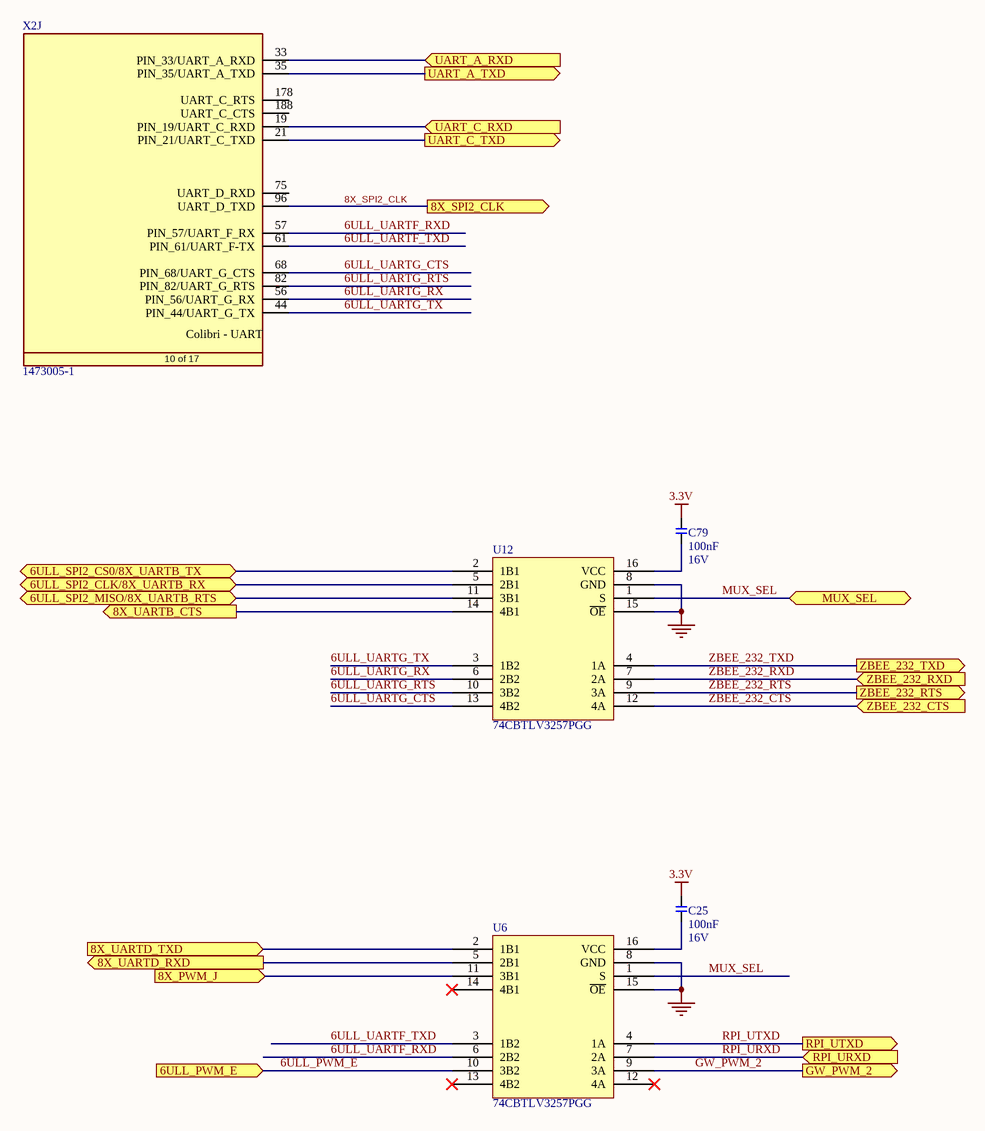
[diagram p9: Serial.SchDoc]

### Parts
C25  Rating: 16V  [T_CAPC0603X33N]  (hidden comment: 100nF)
C79  Rating: 16V  [T_CAPC0603X33N]  (hidden comment: 100nF)
U6  74CBTLV3257PGG  [SOP65P640X120-16N]
U12  74CBTLV3257PGG  [SOP65P640X120-16N]
X2  1473005-1  [T_Tyco_1473005-1]  (part J of 17)

### Ports
6ULL_PWM_E (in), 6ULL_SPI2_CLK/8X_UARTB_RX (bidir), 6ULL_SPI2_CS0/8X_UARTB_TX (bidir), 6ULL_SPI2_MISO/8X_UARTB_RTS (bidir), 8X_PWM_J (in), 8X_SPI2_CLK (out), 8X_UARTB_CTS (out), 8X_UARTD_RXD (out), 8X_UARTD_TXD (in), GW_PWM_2 (out), MUX_SEL (bidir), RPI_URXD (in), RPI_UTXD (out), UART_A_RXD (in), UART_A_TXD (out), UART_C_RXD (in), UART_C_TXD (out), ZBEE_232_CTS (in), ZBEE_232_RTS (out), ZBEE_232_RXD (in), ZBEE_232_TXD (out)

### Nets
3.3V: C25.2 C79.2
GND: U6.8(GND) U6.15(~{OE}) U12.8(GND) U12.15(~{OE})
6ULL_PWM_E: U6.10(3B2) ; port 6ULL_PWM_E
6ULL_SPI2_CLK/8X_UARTB_RX: U12.5(2B1) ; port 6ULL_SPI2_CLK/8X_UARTB_RX
6ULL_SPI2_CS0/8X_UARTB_TX: U12.2(1B1) ; port 6ULL_SPI2_CS0/8X_UARTB_TX
6ULL_SPI2_MISO/8X_UARTB_RTS: U12.11(3B1) ; port 6ULL_SPI2_MISO/8X_UARTB_RTS
6ULL_UARTF_RXD: U6.6(2B2) X2.57(PIN_57/UART_F_RX)
6ULL_UARTF_TXD: U6.3(1B2) X2.61(PIN_61/UART_F-TX)
6ULL_UARTG_CTS: U12.13(4B2) X2.68(PIN_68/UART_G_CTS)
6ULL_UARTG_RTS: U12.10(3B2) X2.82(PIN_82/UART_G_RTS)
6ULL_UARTG_RX: U12.6(2B2) X2.56(PIN_56/UART_G_RX)
6ULL_UARTG_TX: U12.3(1B2) X2.44(PIN_44/UART_G_TX)
8X_PWM_J: U6.11(3B1) ; port 8X_PWM_J
8X_SPI2_CLK: X2.96(UART_D_TXD) ; port 8X_SPI2_CLK
8X_UARTB_CTS: U12.14(4B1) ; port 8X_UARTB_CTS
8X_UARTD_RXD: U6.5(2B1) ; port 8X_UARTD_RXD
8X_UARTD_TXD: U6.2(1B1) ; port 8X_UARTD_TXD
GW_PWM_2: U6.9(3A) ; port GW_PWM_2
MUX_SEL: U6.1(S) U12.1(S) ; port MUX_SEL
RPI_URXD: U6.7(2A) ; port RPI_URXD
RPI_UTXD: U6.4(1A) ; port RPI_UTXD
UART_A_RXD: X2.33(PIN_33/UART_A_RXD) ; port UART_A_RXD
UART_A_TXD: X2.35(PIN_35/UART_A_TXD) ; port UART_A_TXD
UART_C_RXD: X2.19(PIN_19/UART_C_RXD) ; port UART_C_RXD
UART_C_TXD: X2.21(PIN_21/UART_C_TXD) ; port UART_C_TXD
ZBEE_232_CTS: U12.12(4A) ; port ZBEE_232_CTS
ZBEE_232_RTS: U12.9(3A) ; port ZBEE_232_RTS
ZBEE_232_RXD: U12.7(2A) ; port ZBEE_232_RXD
ZBEE_232_TXD: U12.4(1A) ; port ZBEE_232_TXD
NetC25_1: C25.1 U6.16(VCC)
NetC79_1: C79.1 U12.16(VCC)

Not connected (* = marked no-connect by the designer): U6 12(4A)* 13(4B2)* 14(4B1)*; X2 75(UART_D_RXD) 178(UART_C_RTS) 188(UART_C_CTS)

### Notes on the sheet
- Title
- Size:
- Date:
- A3
- Number:
- Time:
- Revision:
- Sheet
- of
- File:
- (in symbol CON-Tyco-1473005-1-200-0.6mm, part J) Colibri - UART; 10 of 17

### Library data of the parts
C25 C79 = C-X7R-100nF-16V-10%-0603: Capacitor Ceramic X7R 100nF 16V 10% 0603; Tolerance: 10%; Type: X7R; Value: 100nF
X2 = CON-Tyco-1473005-1-200-0.6mm: as X2 on sheet Colibri; Manufacturer Part No.: 1473005-1